# EAGLE board Main_Board (EAGLE 7.6.0), part 1 of 2
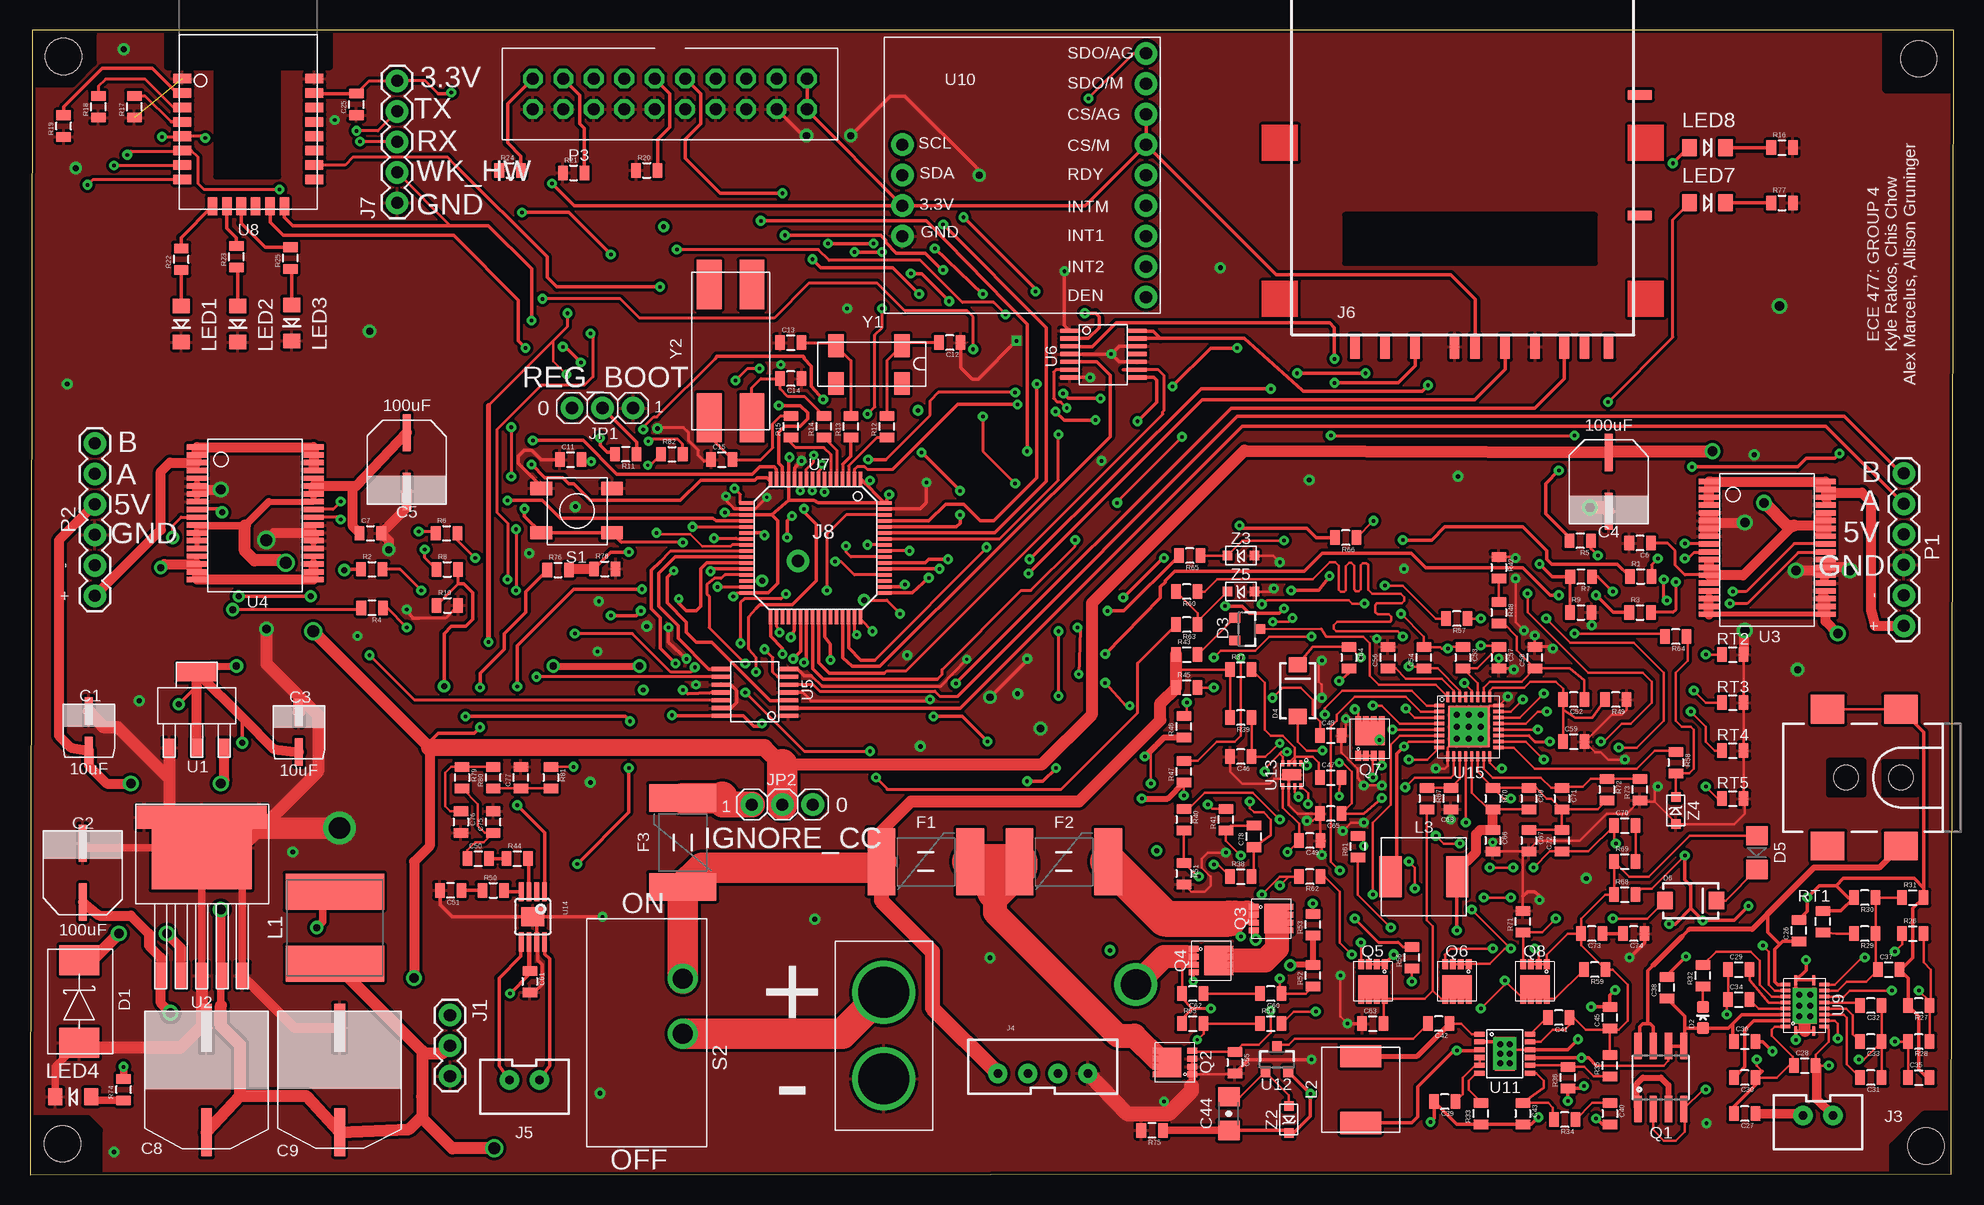
[diagram p9: board, top side]
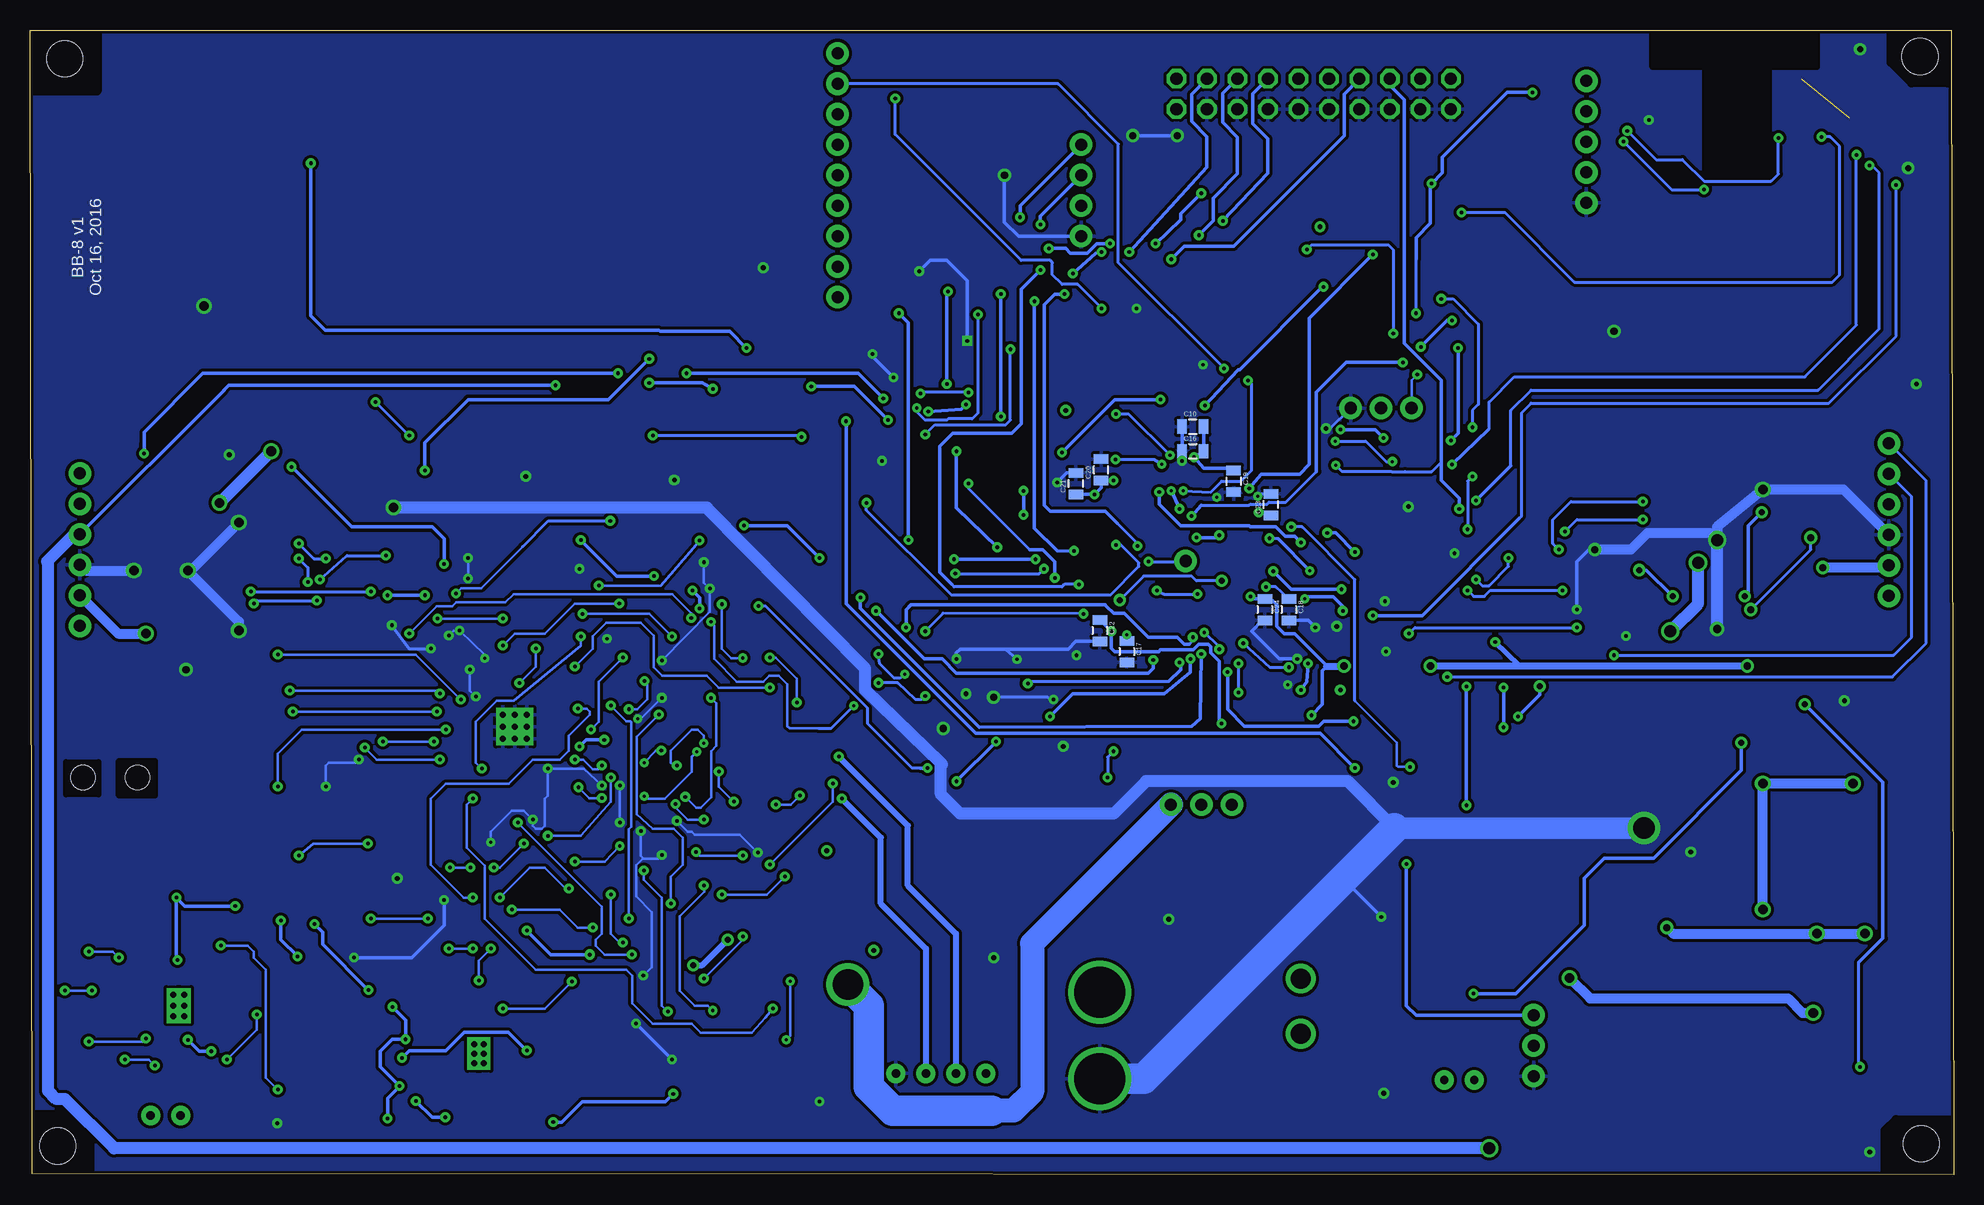
[diagram p10: board, bottom side, seen from below]

Size 160.3 x 95.4 mm. Coordinates in mm from the lower left corner, seen from the top.
Outline: 0,0 160.1,0.1 160.3,95.4 0.2,95.4 0,0
Copper layers (1*16): Top 0.035mm / dielectric 1.5mm / Bottom 0.035mm
Design rules "SparkFun *": minimum track width 5mil, minimum drill 10mil, track to track 5mil, track to pad 5mil, pad to pad 5mil, via to via 5mil, smd to smd 0mil, copper to edge 10mil, drill to drill 10mil, minimum pad ring 12mil, minimum via ring 10mil, stop-mask expansion 4mil, vias tented up to drill 20mil, thermal gap 10mil
Holes 3 mm at 2.7,2.6 158,2.4 157.4,93 2.8,93.2
tRestrict: area 0.5,91 to 5.2,95.1; area 0.1,0.1 to 5.7,4.6; area 154.7,90.5 to 160.2,95.4; area 155.3,0.1 to 160.1,5; area 149.9,31.7 to 152.8,34.5; area 154.5,31.7 to 157.2,34.4; area 11.4,92.3 to 25,95.3; area 15.5,83.2 to 20.7,92.4; area 109.6,76 to 130.4,80
bRestrict: area 0.5,91 to 5.2,95.1; area 0.1,0.1 to 5.7,4.6; area 154.7,90.3 to 160.2,95.4; area 155.3,0.1 to 160.1,5; area 149.9,31.6 to 152.9,34.5; area 154.6,31.7 to 157.3,34.4; area 11.4,92.3 to 25.1,95.4; area 15.4,83.2 to 20.7,92.3

## Footprints (pad centres in the part's own frame; a part is rotated, then mirrored left to right if it is on the bottom)
RADIAL_CAN_SMD-B = smd 0.65 x 2.3: P$1 0,-0.25; P$2 0,3.05
RADIAL_CAN_SMD-D8 = smd 0.65 x 3.1: P$1 0,-0.25; P$2 0,4.65
0805 = smd 0.8 x 1.2: 1 -0.9,0; 2 0.9,0
RADIAL_CAN_SMD-G = smd 0.9 x 4: P$1 0,-0.25; P$2 0,8.46
1206-CAP = smd 1.6 x 1.8: 1 -1.4,0; 2 1.4,0
DO-214AB2 = smd 2.5 x 3.3: A 0,0; C 6.9,0
LED-0603 = smd 1 x 1: A 0,-0.877; C 0,0.877
SOT23-3 = smd 0.8 x 0.9: 1 -0.95,-1; 2 0.95,-1; 3 0,1.1
SMA-DIODE = smd 1.27 x 1.47: A -2.15,0; C 2.15,0
1206-DIODE = smd 1.6 x 1.8: A -1.4,0; D 1.4,0
PTC-2920 = smd 2.3 x 5.6: 1 -3.7,0; 2 3.7,0
1X03 = drill 1.016 pad 1.88: 1 0,0; 2 2.54,0; 3 5.08,0
POWER_JACK_SMD = smd 2.8 x 2.4: GND 0,-5.7; P$4 6.1,-5.7; VIN0 0,5.7; VIN1 6.1,5.7 | hole 2.032: 0,0; 4.572,0
JST-2-PTH-VERT = drill 0.7 pad 1.6: 1 -1.25,-0.55; 2 1.25,-0.55
JST-4-PTH-VERT = drill 0.7 pad 1.6: 1 -3.75,-0.55; 2 -1.25,-0.55; 3 1.25,-0.55; 4 3.75,-0.55
SD-5738 = smd 0.8 x 2: P$1 -6.88,-1; P$2 -4.38,-1; P$3 -1.08,-1; P$4 0.62,-1; P$5 3.12,-1; P$6 5.62,-1; P$7 8.05,-1; P$8 9.75,-1; P$9 -9.38,-1; P$CARDDETECT 11.75,-1 | smd 2 x 0.8: P$COM 14.35,9.95; P$WRITEPROTECT 14.35,20
1X05 = drill 1.016 pad 1.88: 1 0,0; 2 2.54,0; 3 5.08,0; 4 7.62,0; 5 10.16,0
1X01_NO_SILK = drill 1.016 pad 1.88: 1 0,0
SRN8040 = smd 3 x 8.2: P$1 -3,0; P$2 3,0
SPM6530 = smd 1.85 x 3.4: P$1 -2.775,0; P$2 2.775,0
LED-1206 = smd 1.2 x 1.4: A -1.5,0; C 1.5,0
1X06 = drill 1.016 pad 1.88: A 3.81,0; B 6.35,0; GND -1.27,0; MOTOR+ -6.35,0; MOTOR- -3.81,0; VCC 1.27,0
IDC20 = drill 1.02 octagon: P$1 22.86,2.54; P$2 22.86,0; P$3 20.32,2.54; P$4 20.32,0; P$5 17.78,2.54; P$6 17.78,0; P$7 15.24,2.54; P$8 15.24,0; P$9 12.7,2.54; P$10 12.7,0; P$11 10.16,2.54; P$12 10.16,0; P$13 7.62,2.54; P$14 7.62,0; P$15 5.08,2.54; P$16 5.08,0; P$17 2.54,2.54; P$18 2.54,0; P$19 0,2.54; P$20 0,0
SO08 = smd 0.61 x 2.21: 1 -1.905,-2.616; 2 -0.635,-2.616; 3 0.635,-2.616; 4 1.905,-2.616; 5 1.905,2.616; 6 0.635,2.616; 7 -0.635,2.616; 8 -1.905,2.616
SON-8 = smd 0.5 x 0.83: P$1 -0.975,-1.435; P$2 -0.325,-1.435; P$3 0.325,-1.435; P$4 0.975,-1.435; P$5 0.975,1.435; P$6 0.325,1.435; P$7 -0.325,1.435; P$8 -0.975,1.435 | smd 2.45 x 1.9: P$9 0,0.4
5.2X5.2 = smd 1.8 x 1.1: P$1 0,0; P$2 5.9,0; P$3 0,3.7; P$4 5.9,3.7
SWITCH = drill 1.655: P$3 0,4.6; P$4 0,0
SOT-223 = smd 1 x 1.5: P$1 -2.3,0; P$2 0,0; P$3 2.3,0 | smd 3.3 x 1.5: P$4 0,6.3
T0-263-6 = smd 2.16 x 1.07: P$1 0,0; P$2 0,1.7; P$3 0,3.4; P$4 0,5.1; P$5 0,6.8 | smd 6.99 x 8.33: P$6 -10.675,3.4 | smd 1.93 x 1.295: P$7 -13.208,8.191; P$8 -13.208,-1.397
36-BSSOP = smd 1.67 x 0.45: P$1 0,11.05; P$2 0,10.4; P$3 0,9.75; P$4 0,9.1; P$5 0,8.45; P$6 0,7.8; P$7 0,7.15; P$8 0,6.5; P$9 0,5.85; P$10 0,5.2; P$11 0,4.55; P$12 0,3.9; P$13 0,3.25; P$14 0,2.6; P$15 0,1.95; P$16 0,1.3; P$17 0,0.65; P$18 0,0; P$19 9.73,0; P$20 9.73,0.65; P$21 9.73,1.3; P$22 9.73,1.95; P$23 9.73,2.6; P$24 9.73,3.25; P$25 9.73,3.9; P$26 9.73,4.55; P$27 9.73,5.2; P$28 9.73,5.85; P$29 9.73,6.5; P$30 9.73,7.15; P$31 9.73,7.8; P$32 9.73,8.45; P$33 9.73,9.1; P$34 9.73,9.75; P$35 9.73,10.4; P$36 9.73,11.05
14-TSSOP = smd 0.35 x 1.6: P$1 0,0; P$2 0.65,0; P$3 1.3,0; P$4 1.95,0; P$5 2.6,0; P$6 3.25,0; P$7 3.9,0; P$8 3.9,5.6; P$9 3.25,5.6; P$10 2.6,5.6; P$11 1.95,5.6; P$12 1.3,5.6; P$13 0.65,5.6; P$14 0,5.6
LQFP64 = smd 0.3 x 1.2: P$1 -3.82,-6.4; P$2 -3.32,-6.4; P$3 -2.82,-6.4; P$4 -2.32,-6.4; P$5 -1.82,-6.4; P$6 -1.32,-6.4; P$7 -0.82,-6.4; P$8 -0.32,-6.4; P$9 0.18,-6.4; P$10 0.68,-6.4; P$11 1.18,-6.4; P$12 1.68,-6.4; P$13 2.18,-6.4; P$14 2.68,-6.4; P$15 3.18,-6.4; P$16 3.68,-6.4; P$33 3.68,5.1; P$34 3.18,5.1; P$35 2.68,5.1; P$36 2.18,5.1; P$37 1.68,5.1; P$38 1.18,5.1; P$39 0.68,5.1; P$40 0.18,5.1; P$41 -0.32,5.1; P$42 -0.82,5.1; P$43 -1.32,5.1; P$44 -1.82,5.1; P$45 -2.32,5.1; P$46 -2.82,5.1; P$47 -3.32,5.1; P$48 -3.82,5.1 | smd 1.2 x 0.3: P$17 5.68,-4.4; P$18 5.68,-3.9; P$19 5.68,-3.4; P$20 5.68,-2.9; P$21 5.68,-2.4; P$22 5.68,-1.9; P$23 5.68,-1.4; P$24 5.68,-0.9; P$25 5.68,-0.4; P$26 5.68,0.1; P$27 5.68,0.6; P$28 5.68,1.1; P$29 5.68,1.6; P$30 5.68,2.1; P$31 5.68,2.6; P$32 5.68,3.1; P$49 -5.82,3.1; P$50 -5.82,2.6; P$51 -5.82,2.1; P$52 -5.82,1.6; P$53 -5.82,1.1; P$54 -5.82,0.6; P$55 -5.82,0.1; P$56 -5.82,-0.4; P$57 -5.82,-0.9; P$58 -5.82,-1.4; P$59 -5.82,-1.9; P$60 -5.82,-2.4; P$61 -5.82,-2.9; P$62 -5.82,-3.4; P$63 -5.82,-3.9; P$64 -5.82,-4.4
RN4020 = smd 1.5 x 0.8: P$1 -5.5,1.15; P$2 -5.5,-0.05; P$3 -5.5,-1.25; P$4 -5.5,-2.45; P$5 -5.5,-3.65; P$6 -5.5,-4.85; P$7 -5.5,-6.05; P$8 -5.5,-7.25; P$17 5.5,-7.25; P$18 5.5,-6.05; P$19 5.5,-4.85; P$20 5.5,-3.65; P$21 5.5,-2.45; P$22 5.5,-1.25; P$23 5.5,-0.05; P$24 5.5,1.15 | smd 0.8 x 1.5: P$10 -3,-9.5; P$11 -1.8,-9.5; P$12 -0.6,-9.5; P$13 0.6,-9.5; P$14 1.8,-9.5; P$15 3,-9.5
20-VQFN = smd 0.825 x 0.28: P$1 -2.112,0.75; P$10 2.112,0.75; P$11 2.112,-0.75; P$20 -2.112,-0.75 | smd 0.28 x 0.825: P$2 -1.75,1.613; P$3 -1.25,1.613; P$4 -0.75,1.613; P$5 -0.25,1.613; P$6 0.25,1.613; P$7 0.75,1.613; P$8 1.25,1.613; P$9 1.75,1.613; P$12 1.75,-1.613; P$13 1.25,-1.613; P$14 0.75,-1.613; P$15 0.25,-1.613; P$16 -0.25,-1.613; P$17 -0.75,-1.613; P$18 -1.25,-1.613; P$19 -1.75,-1.613 | smd 3 x 2: P$21 0,0 | drill 0.5 pad 0.9 square: P$22 0,0.45; P$23 0.9,0.45; P$24 0.9,-0.45; P$25 0,-0.45; P$26 -0.9,-0.45; P$27 -0.9,0.45
IMU_BREAKOUT = drill 1.016 pad 1.88: 3.3V -10.16,-2.54; CS_AG 10.14,5.08; CS_M 10.14,2.54; DEN 10.14,-10.16; GND -10.16,-5.08; INT1 10.14,-5.08; INT2 10.14,-7.62; INTM 10.14,-2.54; RDY 10.14,0; SCL -10.16,2.54; SDA -10.16,0; SDO_AG 10.14,10.16; SDO_M 10.14,7.62
MSOP-12_GND = smd 0.889 x 0.42: 1 -2.1,1.625; 2 -2.1,0.975; 3 -2.1,0.325; 4 -2.1,-0.325; 5 -2.1,-0.975; 6 -2.1,-1.625; 7 2.1,-1.625; 8 2.1,-0.975; 9 2.1,-0.325; 10 2.1,0.325; 11 2.1,0.975; 12 2.1,1.625 | smd 1.651 x 2.845: 13 0,0 | drill 0.5 pad 0.8 square: P$1 -0.4,0; P$2 0.4,0; P$3 -0.4,0.8; P$4 0.4,0.8; P$5 0.4,-0.8; P$6 -0.4,-0.8
WSON-8 = smd 0.5 x 0.25: P$1 -0.95,0.75; P$2 -0.95,0.25; P$3 -0.95,-0.25; P$4 -0.95,-0.75; P$5 0.95,-0.75; P$6 0.95,-0.25; P$7 0.95,0.25; P$8 0.95,0.75 | smd 0.9 x 1.6: P$GND 0,0
POWER-SOP8 = smd 0.4 x 1.6: 1 -0.975,-2.1; 2 -0.325,-2.1; 3 0.325,-2.1; 4 0.975,-2.1; 5 0.975,2.1; 6 0.325,2.1; 7 -0.325,2.1; 8 -0.975,2.1 | smd 1.89 x 1.57: 9 0,0
S-PVQFN-N32 = smd 0.28 x 0.85: P$1 -1.75,2.475; P$2 -1.25,2.475; P$3 -0.75,2.475; P$4 -0.25,2.475; P$5 0.25,2.475; P$6 0.75,2.475; P$7 1.25,2.475; P$8 1.75,2.475; P$17 1.75,-2.475; P$18 1.25,-2.475; P$19 0.75,-2.475; P$20 0.25,-2.475; P$21 -0.25,-2.475; P$22 -0.75,-2.475; P$23 -1.25,-2.475; P$24 -1.75,-2.475 | smd 0.85 x 0.28: P$9 2.475,1.75; P$10 2.475,1.25; P$11 2.475,0.75; P$12 2.475,0.25; P$13 2.475,-0.25; P$14 2.475,-0.75; P$15 2.475,-1.25; P$16 2.475,-1.75; P$25 -2.475,-1.75; P$26 -2.475,-1.25; P$27 -2.475,-0.75; P$28 -2.475,-0.25; P$29 -2.475,0.25; P$30 -2.475,0.75; P$31 -2.475,1.25; P$32 -2.475,1.75 | drill 0.5 pad 1 square: P$33 0,0; P$34 1,0; P$35 0,1; P$36 -1,0; P$37 1,1; P$38 -1,1; P$39 -1,-1; P$40 0,-1; P$41 1,-1 | smd 3.45 x 3.45: P$GND 0,0
XT60 = drill 4.25 pad 4.675: P$1 0,3.6; P$2 0,-3.6
4-SMD,J-LEAD = smd 1.3 x 1.9: P$1 0,0; P$2 5.5,0; P$3 5.5,3.15; P$4 0,3.15
4-SMD,J-LEAD-2 = smd 4.1 x 2.05: P$1 0,0; P$2 11.1,0; P$3 11.1,3.55; P$4 0,3.55
SOD-323F = smd 0.8 x 0.8: 1 -1.125,0; 2 1.125,0

## Placement (x,y rotation side)
C1  10uF  [RADIAL_CAN_SMD-B]  4.9,35.6 0 top
C2  100uF  [RADIAL_CAN_SMD-D8]  4.4,22.98 0 top
C3  10uF  [RADIAL_CAN_SMD-B]  22.4,35.48 0 top
C4  100uF  [RADIAL_CAN_SMD-D8]  131.55,59.95 180 top
C5  100uF  [RADIAL_CAN_SMD-D8]  31.4,61.6 180 top
C6  470nF  [0805]  134.17,52.64 180 top
C7  470nF  [0805]  28.37,53.46 0 top
C8  470uF  [RADIAL_CAN_SMD-G]  14.7,3.78 0 top
C9  470uF  [RADIAL_CAN_SMD-G]  25.8,3.8 0 top
C10  1uF  [0805]  63.4,62.35 0 bottom
C11  .1uF  [0805]  45.05,59.6 0 top
C12  6.8pF  [0805]  76.65,69.35 180 top
C13  6.8pF  [0805]  63.4,69.35 0 top
C14  20pF  [0805]  63.4,66.35 180 top
C15  20pF  [0805]  57.65,59.6 0 top
C16  100nF  [0805]  63.4,60.3 0 bottom
C17  2.2uF  [0805]  68.9,43.6 270 bottom
C18  2.2uF  [0805]  55.4,47.1 270 bottom
C19  10uF  [0805]  60,57.8 270 bottom
C20  100nF  [0805]  71.05,58.75 90 bottom
C21  100nF  [0805]  73.15,57.6 90 bottom
C22  100nF  [0805]  71.15,45.35 270 bottom
C23  100nF  [0805]  56.9,55.85 90 bottom
C24  100nF  [0805]  57.4,47.1 270 bottom
C25  4.7uF  [0805]  27.2,89.2 90 top
C26  0.1uF  [0805]  147.4,20.35 90 top
C27  270nF  [0805]  142.9,5.1 180 top
C28  2.7nF  [0805]  147.9,9.1 0 top
C29  22nF  [0805]  142.4,17.1 0 top
C30  10nF  [0805]  142.9,8.1 180 top
C31  10nF  [0805]  153.4,8.1 180 top
C32  22nF  [0805]  153.4,14.1 180 top
C33  0.47uF  [0805]  153.4,11.1 180 top
C34  0.47uF  [0805]  142.4,14.6 0 top
C35  0.1uF  [0805]  157.4,8.1 0 top
C36  0.1uF  [0805]  142.9,11.1 0 top
C37  0.1uF  [0805]  154.9,17.1 0 top
C38  4.7uF  [0805]  136.4,15.6 90 top
C39  4.7uF  [0805]  117.9,6.1 180 top
C40  150pF  [0805]  131.65,5.1 270 top
C41  100nF  [0805]  127.4,13.1 180 top
C42  470nF  [0805]  117.4,12.6 180 top
C43  10pF  [0805]  124.4,5.1 270 top
C44  47uF  [1206-CAP]  99.9,5.1 90 top
C45  22uF  [0805]  131.65,13.1 90 top
C46  0.1uF  [0805]  100.9,34.85 180 top
C47  0.1uF  [0805]  108.4,33.1 0 top
C48  0.1uF  [0805]  108.4,36.6 0 top
C49  0.1uF  [0805]  106.65,27.85 180 top
C50  0.1uF  [0805]  37.35,26.35 0 top
C51  0.1uF  [0805]  35.05,23.7 180 top
C52  0.1uF  [0805]  128.65,39.6 180 top
C53  0.1uF  [0805]  119.4,43.1 270 top
C54  0.1uF  [0805]  116.15,43.1 90 top
C55  0.1uF  [0805]  100.4,9.35 270 top
C56  2.2uF  [0805]  113.15,43.1 90 top
C57  0.1uF  [0805]  122.4,43.1 270 top
C58  0.1uF  [0805]  125.4,43.1 90 top
C59  0.1uF  [0805]  128.65,36.1 0 top
C60  0.1uF  [0805]  103.4,15.1 180 top
C61  1uF  [0805]  41.65,16.1 270 top
C62  0.1uF  [0805]  96.9,15.1 180 top
C63  10uF  [0805]  111.9,12.6 0 top
C64  0.1uF  [0805]  109.9,43.1 270 top
C65  1.5uF  [0805]  108.4,30.1 180 top
C66  0.1uF  [0805]  121.9,27.85 270 top
C67  0.1uF  [0805]  124.9,27.85 270 top
C68  1uF  [0805]  118.4,31.35 90 top
C69  0.1uF  [0805]  124.9,31.35 270 top
C70  2.2uF  [0805]  132.9,29.1 0 top
C71  22pF  [0805]  127.65,31.35 270 top
C72  22uF  [0805]  127.65,27.85 90 top
C73  0.1uF  [0805]  130.15,20.1 180 top
C74  0.1uF  [0805]  133.65,20.1 180 top
C75  0.1uF  [0805]  38.6,29.4 90 top
C76  0.1uF  [0805]  35.9,29.4 270 top
C77  0.1uF  [0805]  40.9,33.1 90 top
C78  0.1uF  [0805]  101.99,28.19 90 top
D1  SCHOTTKY_DIODE  [DO-214AB2]  4.1,11 90 top
D2  GREEN  [LED-0603]  139.4,13.1 0 top
D3  BAS16-SOT3  [SOT23-3]  101.4,45.48 270 top
D4  MBRA140  [SMA-DIODE]  105.65,40.35 90 top
D5  D-1206  [1206-DIODE]  143.9,26.85 270 top
D6  MBRA140  [SMA-DIODE]  138.4,22.85 0 top
F1  4A  [PTC-2920]  74.65,26.1 0 top
F2  4A  [PTC-2920]  86.15,26.1 0 top
F3  4A  [PTC-2920]  54.4,27.7 90 top
FRAME1  FRAME-LEDGER  [CREATIVE_COMMONS]  0,-20 0 top  (outside the outline)
FRAME2  FRAME-LEDGER  [CREATIVE_COMMONS]  0,-20 0 top  (outside the outline)
FRAME3  FRAME-LEDGER  [CREATIVE_COMMONS]  0,-20 0 top  (outside the outline)
FRAME4  FRAME-LEDGER  [CREATIVE_COMMONS]  0,-20 0 top  (outside the outline)
FRAME5  FRAME-LEDGER  [CREATIVE_COMMONS]  0,-20 0 top  (outside the outline)
FRAME6  FRAME-LEDGER  [CREATIVE_COMMONS]  0,-20 0 top  (outside the outline)
FRAME7  FRAME-LEDGER  [CREATIVE_COMMONS]  0,-20 0 top  (outside the outline)
FRAME8  FRAME-LEDGER  [CREATIVE_COMMONS]  0,-20 0 top  (outside the outline)
J1  SERVO  [1X03]  35,13.3 270 top
J2  5.5x2.1mm Barrel  [POWER_JACK_SMD]  155.9,33.1 180 top
J3  [JST-2-PTH-VERT]  149,4.4 180 top
J4  BATTERY  [JST-4-PTH-VERT]  84.4,9 0 top
J5  SPEAKER  [JST-2-PTH-VERT]  41.2,7.35 180 top
J6  SDIO-SDCARD  [SD-5738]  119.8,70 0 top
J7  [1X05]  30.6,81 90 top
J8  [1X01_NO_SILK]  64,51.15 0 top
JP1  REG_BOOT  [1X03]  50.25,63.9 180 top
JP2  IGNORE_CC  [1X03]  60.15,30.85 0 top
L1  100uH  [SRN8040]  25.4,20.6 90 top
L2  3.3uH  [SPM6530]  110.9,7.1 90 top
L3  2.2uH  [SPM6530]  116.15,24.85 0 top
LED1  [LED-1206]  12.6,70.9 270 top
LED2  [LED-1206]  17.3,70.9 270 top
LED3  [LED-1206]  21.8,71 270 top
LED4  [LED-1206]  3.6,6.5 180 top
LED7  [LED-1206]  139.8,81 0 top
LED8  [LED-1206]  139.8,85.6 0 top
P1  MOTOR_HEADER  [1X06]  156.15,52.1 90 top
P2  MOTOR_HEADER  [1X06]  5.4,54.6 90 top
P3  JTAG  [IDC20]  41.9,88.8 0 top
Q1  SI9933CDY-PFET  [SO08]  135.9,8.1 0 top
Q2  CSD17308Q3  [SON-8]  95.4,9.35 90 top
Q3  CSD17308Q3  [SON-8]  103.4,21.35 270 top
Q4  CSD17308Q3  [SON-8]  98.4,17.85 270 top
Q5  CSD17308Q3  [SON-8]  111.9,16.1 180 top
Q6  CSD17308Q3  [SON-8]  118.9,16.1 180 top
Q7  CSD17308Q3  [SON-8]  111.65,36.35 0 top
Q8  CSD17308Q3  [SON-8]  125.4,16.1 180 top
R1  4.7K  [0805]  134.23,49.86 0 top
R2  4.7K  [0805]  28.49,50.46 0 top
R3  4.7K  [0805]  134.17,46.86 0 top
R4  4.7K  [0805]  28.5,47.24 180 top
R5  4.7K  [0805]  129.19,52.84 180 top
R6  4.7K  [0805]  34.71,53.46 0 top
R7  .756K  [0805]  129.25,49.84 180 top
R8  .768K  [0805]  34.77,50.45 0 top
R9  .244K  [0805]  129.24,46.86 0 top
R10  .232K  [0805]  34.78,47.45 0 top
R11  10K  [0805]  49.65,60.05 180 top
R12  0  [0805]  71.4,62.35 90 top
R13  0  [0805]  68.4,62.35 90 top
R14  0  [0805]  66.15,62.35 90 top
R15  220  [0805]  63.4,62.35 90 top
R16  100  [0805]  146,85.6 0 top
R17  10K  [0805]  8.7,89 90 top
R18  10K  [0805]  5.7,89 90 top
R19  10K  [0805]  2.8,87.4 90 top
R20  10K  [0805]  51.4,83.7 0 top
R21  10K  [0805]  45.3,83.5 0 top
R22  1K  [0805]  12.6,76.3 90 top
R23  1K  [0805]  17.2,76.5 90 top
R24  10K  [0805]  40,83.7 0 top
R25  1K  [0805]  21.7,76.4 90 top
R26  66  [0805]  156.9,20.1 0 top
R27  196  [0805]  157.4,14.1 180 top
R28  20k  [0805]  157.4,11.1 180 top
R29  4.7k  [0805]  152.9,20.1 180 top
R30  100k  [0805]  152.9,23.1 180 top
R31  100k  [0805]  156.9,23.1 0 top
R32  1500  [0805]  139.4,16.6 90 top
R33  57.6k  [0805]  120.9,5.1 90 top
R34  365k  [0805]  127.9,4.6 180 top
R35  1.3M  [0805]  131.65,9.1 90 top
R36  113k  [0805]  128.15,8.1 90 top
R37  1k  [0805]  100.9,42.1 0 top
R38  1k  [0805]  100.9,24.85 0 top
R39  100  [0805]  100.9,38.1 180 top
R40  5.1k  [0805]  96.15,29.6 270 top
R41  1k  [0805]  99.65,29.6 90 top
R42  5m  [0805]  122.4,50.6 270 top
R43  10  [0805]  96.4,43.35 0 top
R44  150k  [0805]  40.6,26.35 0 top
R45  100  [0805]  96.4,40.6 0 top
R46  100  [0805]  96.15,37.35 90 top
R47  100  [0805]  96.15,33.6 90 top
R48  100  [0805]  122.4,46.85 270 top
R49  100  [0805]  132.15,39.6 180 top
R50  150k  [0805]  38.6,23.7 0 top
R51  5.1k  [0805]  96.15,25.1 270 top
R52  10M  [0805]  106.9,16.6 90 top
R53  5.1k  [0805]  106.9,20.85 90 top
R54  5.1k  [0805]  103.4,12.6 0 top
R55  10M  [0805]  96.9,12.6 0 top
R56  5.1k  [0805]  115.15,18.1 90 top
R57  100  [0805]  118.9,46.35 180 top
R58  100  [0805]  137.15,34.35 270 top
R59  10M  [0805]  130.4,17.1 180 top
R60  100  [0805]  96.4,48.6 180 top
R61  10k  [0805]  110.65,27.35 90 top
R62  5.1k  [0805]  106.65,24.85 180 top
R63  100  [0805]  96.4,45.85 180 top
R64  100  [0805]  137.15,44.85 180 top
R65  1k  [0805]  96.65,51.6 180 top
R66  100  [0805]  109.65,53.1 180 top
R67  1  [0805]  116.4,31.35 270 top
R68  100k  [0805]  132.9,23.35 0 top
R69  2  [0805]  132.9,26.1 0 top
R70  10m  [0805]  121.9,31.35 270 top
R71  10k  [0805]  124.4,21.1 90 top
R72  332k  [0805]  131.4,32.1 270 top
R73  35.63k  [0805]  134.15,32.1 90 top
R74  1K  [0805]  7.8,7.1 90 top
R75  0  [0805]  93.5,3.7 180 top
R76  9.7K  [0805]  44,50.4 0 top
R77  100  [0805]  146,81 0 top
R78  3.3K  [0805]  47.9,50.5 0 top
R79  100  [0805]  36,33.1 270 top
R80  100  [0805]  38.6,33.1 90 top
R81  100  [0805]  43.4,33.1 270 top
R82  100  [0805]  53.49,60.05 0 top
RT1  10K-NTC  [0805]  149.4,21.1 90 top
RT2  10k-NTC  [0805]  141.9,43.35 0 top
RT3  10k  [0805]  141.9,39.35 0 top
RT4  10k  [0805]  141.9,35.35 0 top
RT5  10k  [0805]  141.9,31.35 0 top
S1  RESET_BUTTON  [5.2X5.2]  42.6,53.5 0 top
S2  SWITCH  [SWITCH]  54.4,16.35 180 top
U1  LMS8117  [SOT-223]  13.9,35.6 0 top
U2  5V_BUCK_REG  [T0-263-6]  10.9,16.6 270 top
U3  BTM7752G  [36-BSSOP]  139.9,46.71 0 top
U4  BTM7752G  [36-BSSOP]  13.9,49.6 0 top
U5  SN74LV4T125  [14-TSSOP]  63.2,38.25 90 top
U6  SN74LV4T125  [14-TSSOP]  86.65,70.35 270 top
U7  STM32F405RGT6  [LQFP64]  65.4,51.6 180 top
U8  RN4020RN4020  [RN4020]  18.2,90.2 0 top
U9  BQ51013B-20VQFN  [20-VQFN]  147.9,14.1 90 top
U10  IMU  [IMU_BREAKOUT]  82.86,83.3 0 top
U11  LTC3122-MSOP  [MSOP-12_GND]  122.9,10.1 0 top
U12  CBAT54S-SOT23-3  [SOT23-3]  103.9,9.6 0 top
U13  BQ2947  [WSON-8]  105.15,33.35 270 top
U14  TPA2005D1DGN  [POWER-SOP8]  41.9,21.5 180 top
U15  BQ40Z60  [S-PVQFN-N32]  119.9,37.35 0 top
U$1  XT60  [XT60]  71.15,11.6 180 top
Y1  32.768KHz  [4-SMD,J-LEAD]  72.65,69.1 180 top
Y2  25MHz  [4-SMD,J-LEAD-2]  60.15,63.1 90 top
Z2  DDZ16ASF-7  [SOD-323F]  104.9,4.6 270 top
Z3  MM3Z75VC  [SOD-323F]  100.9,51.6 180 top
Z4  MM3Z75VC  [SOD-323F]  137.15,30.35 90 top
Z5  MM3Z75VC  [SOD-323F]  100.9,48.6 180 top

## Tracks (layer width: path | path; a pad name or v marks a point on that pad's centre or on a via)
3.3V  (via drill 0.3, 0.5, 0.6)
  Top 0.2: 44.8,70.7 43.6,69.5 43.6,67.8 v44.7,66.7
  Top 0.254: U7.P$32 59.7,48.48 58.88,48.48 | 38.2,64.1 44.8,70.7 v44.8,71.8 | 34,90.1 32.94,91.16 J7.5 28.26,91.16 C25.2 | U7.P$48 69.22,46.28 v70.2,45.3
  Top 0.3: v35.1,90.2 35,90.1 34,90.1 | U7.P$19 58.1,55 v57.9,55.2 | 58.88,48.48 v58.6,48.2 | 60.8,37.4 v61,37.6
  Top 0.305: U7.P$64 71.32,56 v71.6,56.7 | v70,57.85 69.75,57.6 69.6,57.6 69.22,57.98 U7.P$1 71.2,56.02 71.2,56 65.7,56 65.32,56.22 63.22,56.22 | v63.3,59.8 63.22,59.58 U7.P$13 63.22,56.22 | v53.5,38.3 53.55,38.25 U5.P$14 59.45,38.25 60.3,37.4 60.8,37.4 | U7.P$19 61.8,55 | 61.8,55 62.3,54.5 62.3,49.3 61.5,48.5 U7.P$32 | 61.8,55 63.22,56.22 | U10.3.3V 45.34,80.76 v43.5,82.6 | U10.CS_AG U10.CS_M | C61.1 41.65,19.32 U14.6 41.58,16.68 v40,15.1 | v17.7,36 17.7,38 17.75,38.05 | v12.4,39.2 13.9,40.7 | U8.P$23 23.75,90.1 C25.2 | U10.CS_M 87.92,80.76 U10.3.3V | P3.P$2 P3.P$1 64.76,88.7 U10.3.3V | 34,90.1 34.1,90.1 | U10.CS_M 103.84,75 118.4,75 120.42,72.98 J6.P$4
  Top 0.406: U1.P$4 14.8,41.9 15.1,42.2 15.1,42.3 15.2,42.4 | 38.2,64.1 v38.2,44.4
  Top 0.6: 15.2,42.4 v17.2,42.4 | v43.6,42.4 v50.8,42.4
  Top 0.61: R74.2 v7.8,9
  Top 0.813: U1.P$2 13.9,40.7 U1.P$4 17.75,38.05 20.32,35.48 C3.P$1
  Bottom 0.2: v44.7,66.7 45.17,66.23 JP1.3
  Bottom 0.254: 58.05,48 C24.1 | v44.8,71.8 44.8,76.3 | v7.8,9 7.9,9.1 7.9,17.7
  Bottom 0.3: v35.1,90.2 37.2,90.2 42.6,84.8 42.6,83.5 v43.5,82.6 43.6,82.5 43.6,79.3 44.8,78.1 44.8,76.3 | v57.9,55.2 57.05,55.1 C23.1 | v58.6,48.2 58.4,48 58.05,48 | v61,37.6 61.2,37.8 61.2,42.8 61.9,43.5 61.9,44 62.1,44.2 62.9,44.2 63.35,43.75 66.1,43.75 66.25,43.6 69.9,43.6 70.2,43.9
  Bottom 0.305: C23.1 56.95,55 | C22.1 v70.2,45.3 70.2,43.9 | C21.1 v71.6,56.7 71.05,57.25 C20.1 v70,57.85 | C10.2 C16.2 v63.3,59.8 62.5,58.9 60.2,58.9 C19.1 | v53.5,38.3 52.6,39.2 52.6,42 52.25,42.35 52.2,42.4 54.9,45.1 55.8,45.1 56.4,45.7 56.4,47.5 56.9,48 C24.1 | v40,15.1 36.5,15.1 30.8,20.8 30.8,24.7 29.1,26.4 25,26.4 17.7,33.7 v17.7,36 | 7.9,17.7 5.9,19.7 5.9,32.7 v12.4,39.2
  Bottom 0.406: v38.2,44.4 37.3,43.5 36.1,42.4
  Bottom 0.6: v17.2,42.4 36.1,42.4 v43.6,42.4 | v50.8,42.4 50.95,42.35 52.25,42.35
5V  (via drill 0.3, 0.8, 1)
  Top 0.3: 106,65.4 101.2,69.7 94.2,69.7 | 106.1,65.3 116,65.3 v116.5,65.8
  Top 0.305: U2.P$4 15.9,16.6 | U6.P$13 94.2,69.7 93.6,70.3 92.3,70.3 U6.P$14 | 106,65.4 106.1,65.3
  Top 0.61: 15.9,16.6 15.9,14.1 15.9,13.6
  Top 0.813: U2.P$4 15.9,16.7 v15.9,22.1 | v15.9,32.6 16.2,32.9 U1.P$3 | v8.4,32.6 6.4,32.6 4.9,34.1 C1.P$1 3.4,35.6 2.4,36.6 2.4,52.87 P2.VCC
  Top 1: 32.66,6.54 32.7,6.5 | 32.7,6.5 32.7,4.9 | 32.7,4.9 32.7,4.7 35.2,2.2 v38.7,2.2 | C8.P$1 17.5,6.58 | 17.5,6.58 17.5,10.8 15.9,12.4 15.9,14.1 | 17.5,6.58 23.02,6.58 C9.P$1 31.6,3.8 32.7,4.9 | L1.P$1 32.7,10.3 32.7,10.1 | 32.7,10.1 32.7,6.5 | J1.2 34.34,10.1 32.7,10.1
  Bottom 0.3: v116.5,65.8 143.72,65.8 144.71,64.81
  Bottom 0.305: P1.VCC 144.71,64.81 144.12,65.4
  Bottom 0.813: v15.9,22.1 v15.9,32.6 v8.4,32.6
  Bottom 1: P1.VCC 156.63,53.37 158.9,51.1 158.8,51 158.8,7 158.1,6.3 157.4,6.3 153.3,2.2 v38.7,2.2
12V_BAT
  Top 0.2: R39.2 R37.1 96,42.1 95.5,42.6
  Top 1: F1.1 70.9,26.15 70.9,28.6 73.4,31.1 87.4,31.1 94.2,37.9 94.2,39.3 R45.1 95.5,42.6 R43.1
  Top 1.27: F1.1 70.95,22.85 75.2,18.6 75.2,13.9 J4.1
  Top 2.54: F1.1 70.45,25.6 56,25.6 F3.1 S2.P$4
12V_CC  (via drill 0.3, 2.54)
  Top 0.2: R72.2 130.65,30.45 C71.2 | C71.2 C72.2 C67.1 | C71.2 126.75,31.35 126.4,31.35 125.5,32.25 C69.1 R70.1 | R70.1 120.65,33.6 U15.P$19 | Q4.P$3 Q4.P$2 Q4.P$1 96.32,18.18 96,17.86 C62.2 | R70.1 122.8,31.35 v123.4,31.35
  Top 0.254: v98.4,13.85 96.85,13.85 | 96.85,13.85 96,13 R55.1 | 96.85,13.85 96,14.7 C62.2
  Top 1.9: 96.32,18.18 94.48,18.18
  Top 1.93: v92.15,15.85 94.48,18.18
  Bottom 0.2: v123.4,31.35 123.9,30.85 123.9,27.25 122.4,25.75 122.4,21.35 118.15,17.1 110.6,17.1 110.1,16.6 110.1,14.3 108.4,12.6 105.15,12.6 104.4,11.85 100.15,11.85 99.03,13.1 v98.4,13.85
  Bottom 2: JP2.3 76.8,19.28 76.8,6.9 78.35,5.35 80.15,5.35
  Bottom 2.54: 80.15,5.35 88.4,5.35 90.4,7.35 90.4,14.1 v92.15,15.85
!NRST  (via drill 0.25, 0.3)
  Top 0.254: v54.4,52.7 49.3,52.7 49.2,52.8 | v51.49,59.13 51.68,59.13 R82.1
  Top 0.305: 49.2,52.8 S1.P$2 S1.P$1 41.2,54.9 v41.2,55.5 | v66.2,56.9 66.22,57.12 U7.P$7
  Bottom 0.254: 42.7,59.5 42.7,59.4 43.5,58.6 45.7,58.6 46.84,58.6 50.95,58.6 v51.49,59.13
  Bottom 0.3: 58.6,54 56.5,54 56.2,53.7
  Bottom 0.305: v54.4,52.7 54.9,53.2 55.7,53.2 56.2,53.7 | 58.6,54 58.7,54.1 64.4,54.1 66.2,55.9 v66.2,56.9 | P3.P$15 46.98,90.78 45.8,89.6 45.8,69.3 42.7,66.2 42.7,59.5 42.7,57.9 41.2,56.4 v41.2,55.5
AC1  (via drill 0.3)
  Top 0.2: C29.1 C34.1 141.5,14.2 141.4,14.1 v141.4,13.35 | v143.9,9.6 143.9,9.1 144.35,8.65 | U9.P$2 145.4,12.35 145.15,12.1 145.15,11.6 146.9,9.85 146.9,9.2 C28.1 | 146.93,9.47 145.55,8.1 C30.1
  Top 0.3: C27.2 142,5.7 143.8,7.5 C30.1 144.35,8.65 | 146.93,9.47 C28.1
  Bottom 0.2: v141.4,13.35 141.4,12.1 v143.9,9.6
AC2  (via drill 0.3)
  Top 0.2: U9.P$19 149.65,12.35 149.9,12.1 149.9,11.1 148.8,10 C28.2 | C31.1 C33.1 | C32.1 C33.1 | C33.1 152.8,9.6 v152.4,9.6 | v149.9,9.1 148.9,9.1
  Top 0.8: 148.9,9.1 148.9,9 | 148.9,9 C28.2 | 148.9,9 148.9,6.3 J3.1
  Bottom 0.2: v152.4,9.6 150.4,9.6 v149.9,9.1
AUDIO+
  Top 0.305: U14.5 40.9,19.38 40.9,18.2 39.1,16.4 39.1,9.1 J5.2
AUDIO-
  Top 0.305: U14.8 42.9,19.38 42.9,18.4 43.3,18 43.3,9.1 J5.1
AUDIO_PWM  (via drill 0.3)
  Top 0.2: v45.3,34 R81.1
  Top 0.254: v55.2,54 U7.P$21
  Bottom 0.2: 49.9,39.5 46.4,36 46.4,34.1 46.3,34 v45.3,34
  Bottom 0.254: 49.9,39.5 49.9,49.6 54.3,54 v55.2,54
BATT  (via drill 0.3)
  Top 0.2: 54.5,53.4 55,53.4 56,52.4 58.4,52.4 58.5,52.5 | 54.5,53.4 54.4,53.4 | 52.3,53.4 54.5,53.4
  Top 0.254: U7.P$24 58.5,52.5 | v52.2,53.5 52.3,53.4
  Top 0.305: R78.1 48.4,51.9 v49.9,51.9
  Top 0.813: R76.2 45,50.5 R78.1
  Bottom 0.305: v49.9,51.9 51.5,53.5 v52.2,53.5
BLU_CMD  (via drill 0.25, 0.3)
  Top 0.254: v4.8,82.5 5.25,82.95 U8.P$8
  Top 0.305: U7.P$27 56.4,51 55.9,50.5 55.9,47.4 55.52,47.02 54.69,47.02 54.08,47.62 v54.08,48.01 | v50.9,47 50.5,46.6 v48.4,46.6
  Bottom 0.254: 36.2,54.7 36,54.9 36,63.5 35.2,64.3 10.4,64.3 4.8,69.9 v4.8,82.5
  Bottom 0.305: v48.4,46.6 44.3,46.6 36.2,54.7 | v54.08,48.01 53.9,48.18 51.69,48.18 50.9,47.4 v50.9,47
BLU_CTS  (via drill 0.3)
  Top 0.3: 35.3,78.3 40.7,72.9 40.7,69.5 v41.3,68.9
  Top 0.305: U7.P$15 62.2,58.02 62.2,58.8 62,59 60.8,59 60.2,58.4 48.9,58.4 46.1,61.2 v41.9,61.2 | 35.3,78.3 21.1,78.3 20,79.4 U8.P$14
  Bottom 0.3: v41.3,68.9 41.3,61.8
  Bottom 0.305: v41.9,61.2 41.3,61.8
BLU_RTS  (via drill 0.3)
  Top 0.254: 35.45,84.15 34.8,84.8 26.9,84.8 26.25,84.15 U8.P$18
  Top 0.3: 35.45,84.15 43.1,76.5 43.1,74.8 43.9,74 | 63.1,62.4 62.9,62.4 62.4,61.9 62.4,61.7
  Top 0.305: U7.P$14 62.7,58.02 62.7,59 62.4,59.3 62.4,61.7 | 63.1,62.4 64.2,62.4 64.8,63 64.8,63.5 64.2,64.1 v62.4,64.1 | v52.5,74 43.9,74
  Bottom 0.305: v62.4,64.1 59.6,67.1 59.5,67.1 52.6,74 v52.5,74
BLU_RX  (via drill 0.3)
  Top 0.254: J7.3 30.58,86.1 v27.5,86.1 | v20.8,82.1 14.5,82.1 14,82.6 14,84.8 13.45,85.35 U8.P$6 12.65,85.3 8.4,85.3 v8.1,85
  Top 0.305: 61.62,57.9 U7.P$16 61.7,57.98 61.7,57.8 61.4,58.1 60.6,58.1 60.4,57.9 55.9,57.9 54.2,56.2 46.7,56.2 45.3,57.6 44.9,57.6 44.4,58.1 42.9,58.1 v41.8,59.2
  Bottom 0.254: 38.8,62.1 38.7,62.2 38.7,64.4 36.6,66.5 12.4,66.5 8.1,70.8 v8.1,85 | v27.5,86.1 23.5,82.1 v20.8,82.1
  Bottom 0.3: 38.8,62.1 v41.8,59.2
BLU_TX  (via drill 0.3)
  Top 0.254: v11,86.5 12.65,86.5 U8.P$5 14.45,86.55 v14.6,86.4 | 59.2,56 59.2,56.7 v58.7,57.2 | J7.4 28.98,87 v27.2,87
  Top 0.3: v41,80.2 44.9,80.2 v48.4,76.7
  Top 0.305: U7.P$17 59.2,56
  Bottom 0.254: v41,80.2 37.4,80.2 31.6,74.4 10.1,74.4 9.5,75 9.5,85.7 10.3,86.5 v11,86.5 | v27.2,87 24.8,84.6 22.6,84.6 20.8,82.8 15.2,82.8 14.6,83.4 v14.6,86.4
  Bottom 0.305: v58.7,57.2 57.7,58.4 54.5,58.4 53.7,59.2 53.7,71.4 v48.4,76.7
BLU_WAKE_HW  (via drill 0.3)
  Top 0.254: J7.2 35.04,79.1 37.4,79.1
  Top 0.3: 41.8,75.5 v41.8,71.2
  Top 0.305: U7.P$22 61,53.5 v61.2,53.3 | v45.9,67.7 44.6,69 v44.4,69 | U8.P$15 21.2,79.8 21.9,79.1 37.4,79.1 38.2,79.1 41.8,75.5 | v63.1,53.1 63.1,54.5 v63.5,54.9
  Bottom 0.254: 62.7,55.8 58.7,55.8 58.6,55.9 57.2,55.9 57.05,56.05 55.65,56.05 53.1,58.6
  Bottom 0.3: v41.8,71.2 42.2,71.2 v44.4,69
  Bottom 0.305: v61.2,53.3 61.4,53.1 v63.1,53.1 | v63.5,54.9 62.7,55.8 | 53.1,58.6 53.1,65.2 50.6,67.7 v45.9,67.7
BLUE_WAKE_SW  (via drill 0.3)
  Top 0.254: v7,84.1 7.05,84.15 U8.P$7
  Top 0.305: U7.P$20 57.2,54.5 56.9,54.7 44.2,54.7 42.7,56.2 v39.8,56.2
  Bottom 0.254: 36.9,59.1 36.9,63.7 35.2,65.4 11.3,65.4 6.2,70.5 6.2,83.5 6.8,84.1 v7,84.1
  Bottom 0.305: v39.8,56.2 36.9,59.1
BOOT2
  Top 0.2: U9.P$17 151.15,13.35 151.4,13.1 151.4,9.2 C31.2
CHRG_GPIO_SYSPRES  (via drill 0.3)
  Top 0.3: R65.2 91.15,47 v89.8,47 | U7.P$42 66.22,44.82 66.7,44.2 v66.7,42.9
  Bottom 0.3: v89.8,47 85.8,43 84.3,43 83.1,41.8 67.1,41.8 66.7,42.2 v66.7,42.9
CHRG_I2C_SCL  (via drill 0.3)
  Top 0.254: U7.P$29 57.9,50 57.6,49.7 57,49.7 56.4,49.2 56.4,48.4 56.6,48.2 56.6,45.6 v59.6,42.6 | v59.6,40.2 64.5,35.3 v70,35.3 | v70.5,33.1 71.4,32.2 71.4,32.1 85.9,32.1 92.3,38.5 92.3,42.65 R63.2
  Bottom 0.254: v59.6,42.6 v59.6,40.2 | v70,35.3 70.5,34.8 v70.5,33.1
CHRG_I2C_SDA  (via drill 0.25, 0.3, 0.5)
  Top 0.2: R64.2 136,45.1 v128.7,45.1 | v105.2,46.4 104.9,46.1 v103.55,46.1
  Top 0.254: U7.P$30 v61,49.5 | v69.5,47.9 71.4,47.9 v72.5,46.75 | v85.7,45.3 v85.7,39.9 | v89.6,41 91.3,39.1 v91.65,39.1
  Bottom 0.2: v128.7,45.1 126.4,47.4 125.1,47.4 124.8,47.7 120.7,47.7 120,48.4 106.8,48.4 105.2,46.8 v105.2,46.4 | v103.55,46.1 103.3,45.75 103.3,43 101.4,41.1 99.2,41.1 98.7,41.6 97.9,41.6 97.2,40.9 97.2,37.4 97,37.2 94.6,37.2
  Bottom 0.254: v61,49.5 63.1,49.5 63.5,49.9 67.5,49.9 v69.5,47.9 | v72.5,46.75 84.2,46.8 v85.7,45.3 | v85.7,39.9 86,39.6 86.5,39.6 88,41 v89.6,41 | 94.6,37.2 93.55,37.2 v91.65,39.1
CHRG_I2C_SMBA  (via drill 0.3)
  Top 0.3: U7.P$33 61.72,44.86 62.7,43.88 v62.7,43.4 | v91.1,48.1 94.4,51.4 v94.5,51.4 | v100.8,54.1 101,53.9 106.4,53.9 107.2,53.1 R66.2
  Bottom 0.3: v62.7,43.4 62.8,38 63.5,37.4 81.2,37.3 91.1,47.2 v91.1,48.1 | v94.5,51.4 97.2,54.1 v100.8,54.1
GND  (via drill 0.25, 0.3, 0.38, 0.4, 0.5, 0.6, 0.7, 0.8, 1, 1.8)  (1 unrouted)
  Top 0.2: v123.15,39.85 123.12,39.85 U15.P$9 121.65,39.1 U15.P$33 118.15,35.6 U15.P$24 118.15,34.1 117.9,33.85 v117.15,33.85 | v123.65,42.1 123.55,42.2 C57.2 v122.4,43.05 | RT2.2 RT3.2 RT4.2 RT5.2 142.9,31.25 142.9,30.1 142.03,29.23 Z4.1 137.15,29.35 135.4,31.1 | C55.2 100.33,8.38 Q2.P$1 | Q2.P$2 Q2.P$3 | 135.4,31.1 134.25,31.1 R73.1 133.05,30.1 131.4,30.1 129.15,27.85 125.65,27.85 124.9,27.1 C67.2 | R49.1 133.05,38.75 132.65,38.35 131.8,38.35 C59.2 130.43,35.23 130.9,35.23 131.53,34.6 v132.9,34.6 | v118.4,29.6 C68.1 | v109.65,38 109.65,36.6 C48.2 109.28,36.58 109.28,35.23 110.65,33.85 110.65,33.1 v111.15,32.45 v112.65,32.45 | v107.65,39.75 107.65,40.85 107.4,41.1 107.4,42.6 v107.65,42.85 | C65.2 105.65,30.1 104.9,30.85 U13.P$6 104.9,33.1 U13.P$GND 104.8,33 103.7,33 103.3,32.6 101,32.6 100,33.6 C46.2 | C65.2 107.5,27.9 C49.1 | R71.2 124.4,23.2 124.4,26.45 C67.2 | C67.2 C66.2 v121.9,27.72 | C58.2 v125.4,44.95 | C65.2 107.53,30.07 107.53,27.73 107.65,27.6 v107.65,26.65 | v109.4,28.65 110.1,29.35 v111.15,29.35 | v135.65,32.35 135.4,32.1 135.4,31.1 | v106.4,29.5 106.9,29.5 C65.2 | R51.2 96.75,23.6 97.9,23.6 98.4,24.1 98.4,24.85 97.65,25.6 97.65,26.35 98.15,26.85 v99.65,26.85 | Z3.1 103.6,51.6 v104.15,51.05 | v103.65,48.85 103.4,48.6 Z5.1 | v124.5,45.35 123.8,46.05 v123.8,49.7 | v123.8,51.4 123.7,51.5 R42.1 | v109.2,16.6 109.2,13.2 v109.8,12.6
  Top 0.254: R10.2 34.63,46.4 32.4,46.4 | U3.P$5 140.46,54.6 141.9,54.6 141.65,54.35 | R9.2 v130.15,45.8 | v126.9,43.85 126.75,44 C58.2 | U5.P$7 63.2,42.1 | v75,39.6 74.8,39.5 65.1,39.5 64.4,40.2 | v78.05,42.95 75.9,40.7 66,40.7 65.1,41.6 | U5.P$4 62.9,40.2 62.8,40.1 | 59.6,55.5 60.45,55.5 v61.4,56.45 | 58.7,55.5 58.1,56.1 v58,56.55 | C15.1 56.75,59.49 56.72,59.46 56.19,59.46 55.7,59.94 55.7,60.38 54.89,61.19 54.89,61.82 54.46,62.26 52.38,62.26 v52.3,62.18
  Top 0.3: U14.9 42.23,21.18 U14.7 | C12.1 77.55,67.25 78.5,66.3 79,66.3 v82.2,69.5 | v86.2,75.3 86.2,70.8 U6.P$1 | U6.P$12 90.75,69.05 v90.1,68.4 | U6.P$10 90.75,67.75 v90.1,68.4 | C11.1 42.6,59.6 41.8,60.4 41.2,60.4 40.7,59.9 40.7,59.3 42.6,57.4 S1.P$3 | U6.P$7 v88.35,66.45 | U6.P$4 v90.1,68.4 | U7.P$63 74.2,55.5 74.7,56 v74.7,57.7 | v54.7,43 53.2,44.4 v53.2,45.6 | U5.P$10 58.4,40.85 58.9,40.35 58.9,39.4 58.4,38.9 U5.P$13 | U5.P$4 64.4,40.2 | C74.1 134.55,19.35 v133.3,18.1 | v125.8,22.9 125.8,23.2 125.4,23.6 124.8,23.6 124.4,23.2 | C55.2 101.55,9.6 v106.8,9.6 | v109.8,12.6 C63.1 | U14.9 v47.7,21.5 | v80,39.8 83.1,42.9 v83.1,43 | C51.2 34.2,23.65 34.2,22.5 35.2,21.5 U14.9 | 63.2,42.1 64,42.1 64.5,41.6 65.1,41.6
  Top 0.305: U7.P$18 59.6,55.5 58.7,55.5 | v64.3,59.5 63.72,58.92 U7.P$12 | C61.2 42,15.2 42.7,15.9 42.7,17.5 42.3,17.9 42.3,19.32 U14.7 | v31.4,47.1 31.9,46.4 32.4,46.4 | v79.1,83.3 79.1,83.7 72.9,89.9 71.7,89.9 v68.4,86.6 | v64.7,86.6 64.42,86.6 P3.P$4 | C14.1 64.35,66.35 64.4,66.4
  Top 0.406: U3.P$24 U3.P$23 149.4,49.54 149.4,50.35 | U3.P$25 U3.P$26 | U3.P$6 U3.P$5 | U4.P$5 U4.P$6 | U4.P$7 U4.P$8 | U4.P$23 U4.P$24 | U4.P$26 U4.P$25
  Top 0.5: Q2.P$1 Q2.P$2
  Top 0.61: U2.P$6 4.4,27.27 C2.P$2 | U2.P$3 U2.P$6 | 4.68,10.88 D1.A 2.1,9 LED4.C | U2.P$5 17.7,23.88 15.99,25.59 15.04,26.54 U2.P$6 | 96.8,7.4 96.83,7.43 Q2.P$2
  Top 0.813: 11.6,29.6 11.75,29.45 13.93,27.27 U2.P$6 | U4.P$24 U4.P$25 20.3,53.5 v19.7,52.9 | U4.P$6 14.2,57.1 | 14.2,57.1 v15.9,57.1 | 14.2,57.1 13.9,57.1 U4.P$7 | C5.P$2 31.4,55.59 C7.2 29.9,52.83 v29.9,52.1 | v151.65,50.35 151.39,50.61 U3.P$25 U3.P$24 | 149.4,50.35 v147.15,50.35 | v142.9,45.35 142.8,45.25 RT2.2 | 140.71,54.35 v142.9,54.35 | U2.P$5 22.04,12.26 C9.P$2
  Top 1: U1.P$1 11.6,33 | 11.6,33 11.6,29.6 | v19.7,45.5 19.7,42.58 | C1.P$2 6.1,37.3 7.3,37.3 11.6,33 | 19.7,42.58 19.72,42.58 24,38.3 24,33.6 15.99,25.59 | U2.P$3 14.3,12.39 | 14.3,12.39 arc90 C8.P$2 | 14.3,12.39 12.51,10.6 4.5,10.6 D1.A | 19.7,42.58 22.4,39.88 C3.P$2 | 17.4,28.9 18.31,29.81 U2.P$7 | U2.P$8 9.86,29.45 11.75,29.45 | C4.P$2 131.2,55.6 v130,55.6
  Top 1.27: J4.4 91.4,5.1 94.9,5.1 96.8,7 96.8,7.4
  Top 1.676: U3.P$6 U3.P$7
  Top 1.778: v25.8,28.9 17.4,28.9 15.04,26.54
  Bottom 0.2: v123.15,39.85 123.65,40.35 v123.65,42.1 | v109.65,38 109.4,38 v107.65,39.75 | v121.9,27.72 121.9,28.6 120.15,30.35 119.15,30.35 v118.4,29.6 118.4,29.1 118.15,28.85 117.65,28.85 117.4,29.1 117.4,31.35 117.15,31.6 v117.15,33.85 114.15,33.85 v112.65,32.45 | v125.4,44.95 125,45.35 v124.5,45.35 122.4,43.35 v122.4,43.05 | v107.65,26.65 107.95,26.35 109.15,26.35 | 109.15,26.35 109.4,26.6 v109.4,28.65 | 111.28,29.48 v111.15,29.35 v111.15,32.45 | v132.9,34.6 133.15,34.35 135.4,34.35 135.65,34.1 v135.65,32.35 | v99.65,26.85 101.15,28.35 104.9,28.35 105.15,28.6 105.5,28.6 v106.4,29.5 | v104.15,51.05 104.15,49.35 v103.65,48.85 103.65,46.9 v107.65,42.85 | v123.8,49.7 v123.8,51.4 | 109.15,26.35 109.25,26.35 109.8,25.8 109.8,23.2 108.5,21.9 108.5,17.3 v109.2,16.6
  Bottom 0.254: v130.15,45.8 128.7,43.85 v126.9,43.85 | v75,39.6 75.4,39.7 75.5,39.8 v80,39.8 | v78.05,42.95 79,43.8 79.2,43.8 | v58,56.55 57.85,56.75 57.45,56.75 | v52.3,62.18 51.97,62.18 JP1.1
  Bottom 0.3: v82.2,69.5 82.2,74.5 83.9,76.2 85.3,76.2 v86.2,75.3 | v88.35,66.45 90.1,68.2 v90.1,68.4 | v74.7,57.7 73.9,58.5 C21.2 | C24.2 57.6,46.2 58.5,45.3 56.2,43 v54.7,43 | v53.2,45.6 53.8,46.2 C18.2 | v133.3,18.1 128.5,18.1 125.8,20.8 v125.8,22.9 | v106.8,9.6 v109.8,12.6 | v47.7,21.5 50.75,24.55 50.95,24.55 | v83.1,43 83.1,43.5 82.8,43.8 79.2,43.8 73.8,43.8 73.15,44.45 C22.2
  Bottom 0.305: 57.45,56.75 C23.2 | v64.3,59.5 C16.1 C10.1 | v29.9,52.1 30.4,52.1 31.4,51.1 v31.4,47.1 | U10.GND 77.92,78.22 79.1,79.4 v79.1,83.3 | v68.4,86.6 v64.7,86.6
  Bottom 0.813: P2.GND 9.17,57.1 v15.9,57.1 19.7,54 v19.7,52.9 20.3,53.5 25.5,53.5 26.9,52.1 v29.9,52.1 | P1.GND 155.67,50.35 v151.65,50.35 | v142.9,45.35 142.9,46.1 v147.15,50.35 146.9,50.35 v142.9,54.35
  Bottom 1: v19.7,45.5 v19.7,52.9 | 84.4,34.3 84.3,34.2 | 46.6,28.9 50.5,32.8 67.3,32.8 70,30.1 82.8,30.1 84.4,31.7 84.4,34.3 | 84.4,34.3 90.7,40.4 90.7,42.2 103.9,55.6 v130,55.6
  Bottom 1.778: 46.6,28.9 v25.8,28.9
  Bottom 2.54: U$1.P$1 67.5,8 50.95,24.55 46.6,28.9
  other vias: 55.5,40.85 82.3,40.1 84.2,37.2 74.2,35.7 62.55,67.5 41.6,51.8 47.4,47.8 47.3,43.6 27.3,44.9 3.1,65.9 28.3,70.3 99.2,75.6 106.6,57.9 119,58.2 147.3,42.1 145.8,72.4 47.5,6.8 65.4,21.3 80,18.1 46.7,32.7 21.9,26.9 7,1.9 9.1,39.5 51.4,45.7 68.1,72.2 143.7,60 139.7,4.3 129.7,24.7 94.5,6.1 114.5,50.5 89.3,59.5 73.1,43.3 25.4,87.9 3.8,83.9 7.8,93.8 45.44,55.68 112.22,44.68
  pour Top (isolate 0.254): 160.1,0.1 0.2,0.1 0.2,95.4 160.1,95.4
  pour Bottom (isolate 0.254): 160.2,0 0.3,0 0.3,95.3 160.2,95.3
IMU_I2C_SCL  (via drill 0.3)
  Top 0.3: U7.P$61 74.9,54.5 76.3,55.9 77.8,55.9 79.2,54.5 80.3,54.5
  Top 0.305: v77.8,79.8 83.8,73.8 v83.8,73.6 | v83.9,65.9 83.9,58.1 80.3,54.5
  Bottom 0.305: U10.SCL 77.8,80.74 v77.8,79.8 | v83.8,73.6 83.9,73.5 v83.9,65.9
IMU_I2C_SDA  (via drill 0.3)
  Top 0.305: v76.1,79.2 84.7,70.6 84.7,57.8 80.4,53.5 U7.P$59
  Bottom 0.305: U10.SDA 76.1,79.9 v76.1,79.2
IMU_SDO_AG  (via drill 0.25, 0.3)
  Top 0.254: U7.P$10 64.7,58.02 64.7,58.8 65.3,59.4 v65.3,59.95 | v69.8,63.4 70.4,64 70.4,70 71,70.6 v71,72.2 | v88.2,89.7 91.96,93.46 U10.SDO_AG
  Bottom 0.254: 69.3,63.4 v69.8,63.4 68.75,63.4 v65.3,59.95 | v71,72.2 73,74.2 74.3,74.2 75.1,75 75.1,76 75.3,76.2 77.7,76.2 88.2,86.7 v88.2,89.7
IMU_SDO_M  (via drill 0.25, 0.3)
  Top 0.254: U7.P$11 64.2,58 v64.2,57 | v58.8,66.2 59.8,67.2 v60.8,67.2
  Bottom 0.254: v64.2,57 61.9,56.9 61,57.8 59.4,57.8 58.5,58.7 58.5,65.9 v58.8,66.2 | v60.8,67.2 69.6,76 69.6,85.9 74.62,90.92 U10.SDO_M
JNTRST  (via drill 0.3)
  Top 0.254: v73.3,52 U7.P$56
  Top 0.3: v68.7,76.9 v71,76.9 | v73.4,75.1 74.3,75.1 v76.6,72.8
  Bottom 0.254: 74.7,52 v73.3,52
  Bottom 0.3: v68.7,76.9 62.22,83.98 62.22,86.52 63.5,87.8 63.5,90.06 P3.P$3 | v71,76.9 71.5,76.8 v73.4,75.1 | v76.6,72.8 76.6,53.9 74.7,52
JTCK  (via drill 0.3)
  Top 0.254: v79.4,63.2 79.4,60.3 v82.1,57.6
  Top 0.3: v75.4,77.2 v79.4,73.4 | v74.9,49.75 73.5,48.5 U7.P$49 | v70.3,77.6 v66.5,77.6 | v62.7,81.8 57.5,81.8 54.6,84.7 54.6,86.3 55.9,87.6 55.9,90.1 54.66,91.34 P3.P$9
  Bottom 0.254: v82.1,57.6 82.1,57.2 77,52.1
  Bottom 0.3: v79.4,73.4 v79.4,63.2 | 77,52.1 75.9,52.1 74.9,51.1 v74.9,49.75 | v75.4,77.2 74,77.2 73.6,76.8 72.2,76.8 71.4,77.6 v70.3,77.6
  Bottom 0.305: v66.5,77.6 64.4,79.6 64.4,80.1 v62.7,81.8
JTDI  (via drill 0.3)
  Top 0.3: U7.P$50 72.7,49 v72.9,49.2 | v76.1,75.4 76,75.4 74.6,76.8 72.2,76.8 71.3,77.7 71.3,77.9 70.9,78.3 v62.9,78.3
  Bottom 0.254: v72.9,49.2 74.1,49.2 74.3,49 83.3,49 83.5,49.2
  Bottom 0.3: v76.1,75.4 77.7,73.8 77.7,62.6 78.5,61.8 83.4,61.8 84.5,60.7 84.5,50.2 83.5,49.2 | v62.9,78.3 61.7,79.5 61.7,81.4 59.68,83.42 59.68,86.48 60.9,87.7 60.9,90.12 P3.P$5
JTDO  (via drill 0.3)
  Top 0.254: U7.P$55 68.4,51.5 68,51.9 v68,52.4
  Top 0.3: v74.1,73.4 71.9,75.6 65.9,75.6 v65.2,76.3
  Bottom 0.254: v68,52.4 68,52.6 69.7,54.3
  Bottom 0.3: 69.7,54.3 70.7,55.3 75.3,55.3 75.8,55.8 75.8,72.5 74.9,73.4 v74.1,73.4 | v65.2,76.3 64.1,77.4 60,77.4 50.8,86.6 50.8,90.06 P3.P$13
JTMS  (via drill 0.3)
  Top 0.254: v79.7,52.3 79.7,52.2 70.4,42.9
  Top 0.3: U7.P$46 68.21,43.91 69.22,42.9 70.4,42.9 | v83.1,60.3 83.1,70.9 74.7,79.5 v60.9,79.5
  Bottom 0.3: v79.7,52.3 83.1,55.6 v83.1,60.3 | v60.9,79.5 57.14,83.46 57.14,86.34 58.4,87.6 58.4,90.08 P3.P$7
M1_A_3.3  (via drill 0.25, 0.3)
  Top 0.254: v57,53.05 58.85,53.05 58.9,53 U7.P$23
  Top 0.305: U5.P$3 63.15,39.5 61.7,39.5 56.8,44.4 55.5,44.4 54.7,45.2 54.7,46.04 53.09,47.65 53.09,49.78 v53.65,50.34
  Bottom 0.254: 56.3,53 56.95,53 v57,53.05
  Bottom 0.305: 56.3,53 v53.65,50.34
M1_A_5
  Top 0.305: P1.A 149.66,62.4 101,62.4 77.5,38.9 U5.P$2
M1_B_3.3  (via drill 0.27, 0.3)
  Top 0.254: U5.P$6 62.3,41.5 61.9,41.9 61.9,43.1 v61.2,43.8 | v62.45,45.2 62.4,45.5 62.22,45.68 U7.P$34
  Bottom 0.254: v61.2,43.8 61.2,44 v62.45,45.2
M1_B_5
  Top 0.254: U5.P$5 65.25,40.85 65.8,40.3 75.4,40.3 75.8,39.9 77.3,39.9
  Top 0.3: 78.25,40.85 77.3,39.9
  Top 0.305: P1.B 155.95,58.45 151.2,63.2 100.6,63.2 78.25,40.85
M2_A_3.3  (via drill 0.3)
  Top 0.254: U7.P$25 59.67,51.95 53.35,51.95 52.5,51.1
  Top 0.305: v53.8,42.6 52.5,43.9 52.5,46.43 51.77,47.17 51.77,50.37 52.5,51.1 | U5.P$11 54.83,40.1 v54.4,40.4
  Bottom 0.305: v54.4,40.4 53.9,41.1 v53.8,42.6
M2_A_5  (via drill 0.3)
  Top 0.254: U5.P$12 32.05,39.55 v28.3,43.3
  Bottom 0.254: v28.3,43.3 5,43.3 3.5,44.8 3.5,56.51 P2.A
M2_B_3.3
  Top 0.305: U5.P$8 56.55,42.15 54,44.7 | U7.P$26 53.79,51.5 52.4,50.11 52.4,47.37 54,45.77 54,44.7 | 54,44.7
M2_B_5  (via drill 0.3)
  Top 0.254: U5.P$9 v42.2,41.5
  Bottom 0.254: v42.2,41.5 5.1,41.5 2.3,44.3 2.3,57.85 P2.B
MC1_IN1  (via drill 0.3)
  Top 0.3: R1.1 132.29,50.9 126.8,50.9 126.4,51.3 126.4,52 124.4,54 117.9,54 116.8,52.9 v114.4,52.9 | v108.3,49.9 107.4,48.7 v105.1,48.7 | v104.5,47.2 104.1,46.8 101.6,46.8 101,47.4 v99.6,47.4 | v85.5,33.9 84.4,32.8 v83.1,32.8 | v79.8,36.1 77.7,38.2 v75.3,38.2 | v63.6,43 64.22,43.62 U7.P$38
  Bottom 0.254: 86.1,33.9 86.8,33.9 90.5,37.6 90.5,38.9 99,47.4 v99.6,47.4
  Bottom 0.3: v114.4,52.9 111.4,49.9 v108.3,49.9 | v105.1,48.7 104.5,48.1 v104.5,47.2 | 86.1,33.9 v85.5,33.9 | v83.1,32.8 v79.8,36.1 | v75.3,38.2 73.4,40.1 65.8,40.1 63.6,41.9 v63.6,43
MC1_IN2  (via drill 0.25, 0.3)
  Top 0.254: v87.3,45.6 87.5,45.4 v87.4,41.7
  Top 0.3: U7.P$37 63.7,46.48 63.7,45.4 v63.4,44.8 | v89.6,43.4 94.2,48.1 94.2,49 94.6,49.4 94.6,49.5 95.4,50.3 106.2,50.3 107.7,51.8 115.1,51.8 116.3,50.6 124.4,50.6 126.7,48.3 v127.4,48.3 | v130.5,48.3 131.94,46.86 R3.1
  Bottom 0.254: v87.4,41.7 87.8,41.4 88.3,41.4 89.5,42.6 v89.6,43.4 | v63.4,44.8 63.4,44.5 63.7,44.2 | 70.6,47.4 70.7,47.5
  Bottom 0.3: 63.7,44.2 64.1,44.2 64.7,44.8 67.1,44.8 69.1,46.8 70,46.8 70.6,47.4 | 87,47.4 87.3,47.1 | 87.3,47.1 v87.3,45.6 | v127.4,48.3 v130.5,48.3 | 70.7,47.5 86.9,47.5 87.3,47.1
MC1_INH_3.3  (via drill 0.3)
  Top 0.254: 75.6,41.3 76,41.7 76,42.1 82.6,48.7 83.4,48.7 87.1,52.4 v87.1,52.9
  Top 0.305: U6.P$2 88.2,69.7 89.1,70.6 89.1,71.5 88.8,71.8 v87.9,71.8 | 75.6,41.3 66.1,41.3 65.22,42.18 U7.P$40
  Bottom 0.305: v87.1,52.9 87.1,71 v87.9,71.8
MC1_INH_5  (via drill 0.3)
  Top 0.305: U6.P$3 86.7,69 88.5,69 90.5,71 108.3,71 108.7,70.6 v108.7,68 | v127.4,58.7 126.3,57.6 126.3,55.1 128.29,53.11 R5.2
  Bottom 0.305: v108.7,68 112.1,64.6 123.8,64.6 127.4,61 v127.4,58.7
MC1_IS  (via drill 0.25, 0.3)
  Top 0.254: R9.1 R7.2 | U7.P$8 65.7,58.02 65.7,58.6 66.1,59 v66,59.2 | 71.3,59.6 75,63.3 75,64.5 75.7,65.2 v82.1,65.2
  Top 0.3: v111.3,66.8 v105.6,66.8 | v89.2,64.7 86.5,64.7 v86.1,65.1 | 71.3,59.6 v69.85,59.6
  Top 0.305: v150.8,60.1 150.4,59.7 148,59.7 147.3,59 v138.5,59 | v125.8,50.9 126.86,49.84 R7.2
  Bottom 0.254: v66,59.2 66.6,59.6 v69.85,59.6 | v82.1,65.2 86,65.2 v86.1,65.1
  Bottom 0.3: 150.8,60.9 150.8,61.9 145.9,66.8 v111.3,66.8 | v105.6,66.8 91.3,66.8 v89.2,64.7
  Bottom 0.305: 150.8,60.9 v150.8,60.1 | v138.5,59 133.5,54 126.8,54 125.8,53 v125.8,50.9
MC2_IN1  (via drill 0.3)
  Top 0.254: U7.P$58 80.8,53 85.7,57.9 v85.7,61.7 | v78.6,68.8 78.6,71.5 78.1,72 72.9,72 70.6,74.3 64.9,74.3 62,71.4 50.8,71.4 49.2,73 v42.7,73 | v40.1,62.3 v40.1,58.2 | v40.5,53.8 v40.5,48.7 | v32.6,48.7 30.84,50.46 R2.2
  Bottom 0.254: v85.7,61.7 84.9,62.5 79,62.5 78.6,62.9 v78.6,68.8 | v42.7,73 41.7,73 39.6,70.9 39.6,64.2 40.1,63.7 v40.1,62.3 | v40.1,58.2 40.5,57.8 v40.5,53.8 | v40.5,48.7 40,48.2 39.1,48.2 38.6,48.7 v32.6,48.7
MC2_IN2  (via drill 0.3)
  Top 0.254: U7.P$62 68,55 66.4,53.4 v66.4,48.7 | v63,48.4 62.6,48 59.5,48 59.2,47.7 v59.2,44.3 | v55.4,42.3 55.1,41.9 53.4,41.9 50.2,45.1 v45.4,45.1 | v31.4,45.6 29.76,47.24 R4.1
  Bottom 0.254: v66.4,48.7 65.8,48.4 v63,48.4 | v59.2,44.3 57,42.3 v55.4,42.3 | v45.4,45.1 44.9,45.6 v31.4,45.6
MC2_INH_3.3
  Top 0.3: U6.P$5 88.9,67.75 90,66.65 90,65.4
  Top 0.305: 90,65.4 90,61.5 70.8,42.4 68.5,42.4 67.72,43.08 U7.P$45
MC2_INH_5  (via drill 0.25, 0.3)
  Top 0.254: U6.P$6 85.5,67.1 85.3,66.9 85.3,64.7 85.6,64.4 85.9,64.4 v86.4,63.9 | v81.3,71.7 80.3,72.7 77.7,72.7 74.2,76.2 66.6,76.2 65.7,77.1 v53.9,77.1 | v46.7,70.1 46.9,69.9 46.9,66.5 46.2,65.8 42.6,65.8 38.9,62.1 38.9,55.2 39.8,54.3 v39.8,49.6 | v37.1,51.4 35.61,52.89 R6.2
  Bottom 0.254: v81.3,71.7 81.3,63.5 81.8,63 83.8,63 83.9,62.9 85.7,62.9 86.4,63.6 v86.4,63.9 | v53.9,77.1 53.5,77.5 47.1,77.5 46.7,77.1 v46.7,70.1 | v39.8,49.6 39.3,49.1 38.7,49.1 37.1,50.7 v37.1,51.4
MC2_IS  (via drill 0.25, 0.3, 0.5)
  Top 0.254: R10.1 35.67,49.24 R8.2 | v60.5,41.9 60.5,43.1 59.9,43.8 59.9,46.5 60.5,47.2
  Top 0.305: U7.P$9 65.2,57.98 v65.2,57 | v64.5,55.5 64.5,55.2 65.5,54.2 65.5,49.5 63.5,47.5 60.8,47.5 60.5,47.2 | v50,37.8 49.6,38.2 v36.3,38.2 | v34.5,40.7 34.5,45.1 35.1,45.7 36.3,45.7 36.9,46.3 36.9,48.5 36.16,49.24 35.67,49.24
  Bottom 0.305: v65.2,57 v64.5,55.5 | v60.5,41.9 60.5,38.8 59.1,37.4 52.9,37.4 52.5,37.8 v50,37.8 | v36.3,38.2 34.5,40 v34.5,40.7
N$1
  Top 0.406: U3.P$3 139.9,56.1 U3.P$4 | 149.65,56.35 149.63,56.33 U3.P$33 149.9,56.08 149.9,56.85
  Top 0.813: U3.P$1 139.9,57.6 | 139.9,57.6 U3.P$2 | U3.P$2 U3.P$3 139.9,56.35 | 139.9,56.1 U3.P$2 | 139.9,57.6 140.06,57.76 U3.P$36 U3.P$35 U3.P$34 149.65,56.44 149.65,56.35 | 149.9,56.85 152.65,56.85 153.4,56.1 153.4,47.1 153.75,45.75 P1.MOTOR+
N$2  (via drill 0.8)
  Top 0.406: U3.P$16 U3.P$15 | U3.P$21 U3.P$22 149.15,48.18 149.15,46.85 149.01,46.71 U3.P$18
  Top 0.813: v150.65,45.1 149.63,46.12 U3.P$19 U3.P$20 U3.P$21 | U3.P$18 U3.P$17 U3.P$16
  Bottom 0.813: P1.MOTOR- 152.96,45.1 v150.65,45.1
N$3  (via drill 0.3)
  Top 0.254: U3.P$9 139.86,52.6 v137.9,52.6 | v135.65,51.35 135.13,50.83 R1.2
  Bottom 0.254: v137.9,52.6 136.65,51.35 v135.65,51.35
N$4  (via drill 0.3)
  Top 0.254: U3.P$10 139.84,51.85 138.65,51.85 138.15,51.35 v137.9,51.35 | v137.15,49.4 137.15,47.1 136.91,46.86 R3.2
  Bottom 0.254: v137.9,51.35 137.15,50.6 v137.15,49.4
N$5  (via drill 0.3)
  Top 0.254: U3.P$28 149.59,52.6 147,52.6 143,48.6 v141.9,48.6 | v131.9,48.6 130.66,49.84 R7.1
  Bottom 0.254: v141.9,48.6 v131.9,48.6
N$6  (via drill 0.3)
  Top 0.254: U3.P$27 149.57,51.85 147.35,51.85 143.1,47.6 v141.65,47.6 | v136.4,47.85 136.15,48.1 v136.15,49.6 | v130.65,51.6 130.09,52.16 R5.1
  Bottom 0.254: v141.65,47.6 141.4,47.85 v136.4,47.85 | v136.15,49.6 133.9,51.6 v130.65,51.6
N$7
  Top 0.3: R19.2 2.8,89 6,92.2 10.2,92.2 12.25,90.15 U8.P$2
N$8
  Top 0.254: U4.P$33 23.65,58.96 23.65,59.06
  Top 0.406: U4.P$3 U4.P$4
  Top 0.813: P2.MOTOR+ 10.9,53.75 10.9,58.6 11.65,59.35 U4.P$3 U4.P$2 U4.P$1 U4.P$36 U4.P$35 U4.P$34 23.63,59.06 23.65,59.06
N$9  (via drill 0.6)
  Top 0.4: U4.P$16 U4.P$15
  Top 0.406: U4.P$21 U4.P$22
  Top 0.813: v10.9,50.6 11.2,50.9 U4.P$16 U4.P$17 U4.P$18 U4.P$19 U4.P$20 U4.P$21
  Bottom 0.813: P2.MOTOR- 5.59,50.6 v10.9,50.6
N$10  (via drill 0.5)
  Top 0.305: R2.1 26.26,50.46 v26.2,50.4 | v23.4,48.2 v17.4,48.2 | v16,55.2 15.7,55.5 13.95,55.5 U4.P$9
  Bottom 0.305: v26.2,50.4 25.6,50.4 v23.4,48.2 | v17.4,48.2 17.1,48.5 17.1,54.1 v16,55.2
N$11  (via drill 0.6)
  Top 0.254: R4.2 27.46,47.1 v16.9,47.1 | v11.9,53.1 11.9,54.1 12.6,54.8 U4.P$10
  Bottom 0.254: v16.9,47.1 11.9,52.1 v11.9,53.1
N$12
  Top 0.254: R12.2 71.4,67.85 Y1.P$1 72.9,69.1 73.15,69.35 C12.2
N$13  (via drill 0.3)
  Top 0.254: R8.1 32.9,51.42 v32.9,52.1 | v25.9,56.1 25.25,55.45 U4.P$28
  Bottom 0.254: v32.9,52.1 33.4,52.6 33.4,54.6 31.9,56.1 v25.9,56.1
N$14  (via drill 0.3)
  Top 0.254: R6.1 33.67,53.6 v32.4,53.6 | v25.9,54.6 25.7,54.8 U4.P$27
  Bottom 0.254: v32.4,53.6 31.4,54.6 v25.9,54.6
N$15  (via drill 0.25)
  Top 0.254: U7.P$47 68.7,46.48 68.7,45.2 v68.9,45
  Bottom 0.254: v68.9,45 C17.1
N$16  (via drill 0.3)
  Top 0.254: v57.3,49 U7.P$31
  Bottom 0.254: C18.1 56.5,49 v57.3,49
N$17
  Top 0.254: Y2.P$4 56.6,61.55 C15.2 60.9,59.6 61.9,60.6 61.9,62.6 62.55,63.25 R15.2
N$18
  Top 0.254: R13.2 68.4,67.85 Y1.P$2 66.9,69.1 66.65,69.35 C13.2
N$19
  Top 0.254: R14.1 67.22,60.38 U7.P$5
N$20
  Top 0.254: Y2.P$1 60.15,65.6 60.9,66.35 C14.2 62.5,65.5 63.15,64.85 64.55,64.85 R14.2
N$21
  Top 0.254: R13.1 68.5,61.35 | 67.72,59.22 U7.P$4
  Top 0.305: 67.72,59.22 68.4,59.9 R13.1
N$22  (via drill 0.3)
  Top 0.254: 51.2,62.1 51.2,62.38 51.99,63.17 52.24,63.17 57.14,68.07
  Top 0.3: U7.P$60 77.2,54 77.5,54.3 v77.5,55 | v77.5,57 v74.3,60.2 | v66.1,64.6 65.1,65.7 65.1,67.4 64.5,68 | 51.2,62.1 v51.1,62.1 | v47.5,61.4 47.5,60.8 48.1,60.2 48.6,60.2 R11.2
  Top 0.305: 57.1,68 57.14,68.07 57.23,68.2 64.38,68.23 arc-90 64.5,68
  Bottom 0.3: v77.5,55 v77.5,57 | v74.3,60.2 69.9,64.6 v66.1,64.6 | v51.1,62.1 48.2,62.1 v47.5,61.4
N$23
  Top 0.3: JP1.2 50.55,61.06 R11.1
N$24
  Top 0.305: R20.2 52.3,86.3 53.3,87.3 53.3,90.1 P3.P$11
N$25
  Top 0.305: R21.2 46.2,87.2 45.8,87.6 45.8,89.98 P3.P$17
N$26
  Top 0.305: R24.2 40.9,84.9 39.8,86 39.8,89.24 P3.P$19
N$27
  Top 2.184: JP2.1 57.7,30.85 57.7,31.5
  Top 2.54: F3.2 57.7,31.4 57.7,31.5
N$28
  Top 0.254: 11.75,87.75 9.6,89.9 R17.2
  Top 0.305: 11.75,87.75 U8.P$4
N$29
  Top 0.254: U7.P$3 68.22,59.07 70.6,61.45 R12.1
N$30
  Top 0.254: U7.P$6 66.72,60.03 66.15,60.6 63.8,60.6 63.4,61 R15.1
N$31  (via drill 0.6, 0.8)
  Top 0.61: D1.C 4.8,17.5 | v23.9,20.6 24.4,21.1 24.4,22.6 L1.P$2
  Top 0.813: U2.P$2 12.6,18.9 v11.4,20.1
  Top 1: 4.8,17.5 v7.4,20.1
  Bottom 0.61: 23.4,20.1 v23.9,20.6
  Bottom 0.813: v7.4,20.1 v11.4,20.1 23.4,20.1
N$32
  Top 2.54: S2.P$3 67.7,11.75 U$1.P$2
N$33  (via drill 0.3)
  Top 0.2: R41.2 98.5,30.5 v98.15,30.85 | v96.15,31.6 R47.1
  Top 0.5: v92.65,31.35 94.8,31.35 R47.1
  Bottom 0.2: v98.15,30.85 96.9,30.85 v96.15,31.6
  Bottom 0.5: v92.65,31.35 89.4,28.1 89.4,22.6 85.65,18.85 J4.3
N$34
  Top 0.305: U8.P$10 12.6,78.1 R22.2
N$35
  Top 0.305: R22.1 LED1.A
N$36
  Top 0.305: U8.P$11 16.4,78.9 17.2,78.1 R23.2
N$37
  Top 0.305: U8.P$12 17.6,79.3 19.6,77.3 R25.2
N$38
  Top 0.305: R23.1 17.3,75.5 LED2.A
N$39
  Top 0.305: R25.1 21.8,75.4 LED3.A
N$40
  Top 0.2: U13.P$2 U13.P$3 104.9,34.35 105.4,34.85 | C47.1 107.4,33.2 107.4,34.35 106.9,34.85 105.4,34.85 | 105.4,34.85 105.4,34.6 | 105.4,34.6 105.4,34.35 105.15,34.35 105.4,34.6 | R37.2 102.9,41 102.9,37.1 103.4,36.6 104.4,36.6 105.4,35.6 105.4,34.85
N$41  (via drill 0.3)
  Top 0.254: U7.P$2 68.72,58.8 68.92,59 69.55,59 69.75,58.8 71.9,58.8
  Top 0.3: 71.9,58.8 77.3,64.2 v82.3,64.2 | v85.45,63.6 86.2,62.9 v88.8,62.9 | v95.2,65.7 98.4,68.9 v100.6,68.9 | v136.9,84.3 138.2,85.6 LED8.A
  Bottom 0.3: v82.3,64.2 82.7,63.8 v85.45,63.6 | v88.8,62.9 91.6,65.7 v95.2,65.7 | v100.6,68.9 102,70.3 107.8,70.3 107.9,70.4 135.7,70.4 136.9,71.6 v136.9,84.3
N$42
  Top 0.61: LED4.A 5.4,6.2 R74.1
N$43  (via drill 0.3)
  Top 0.254: U7.P$52 68.7,50 67.6,51.1 v67.1,51.1
  Bottom 0.254: v67.1,51.1 64.05,51.1 J8.1
N$44
  Top 0.2: R81.2 C77.1 R80.1
N$45
  Top 0.2: R80.2 R79.1 35.1,34 34.6,33.5 34.6,30.7 35,30.3 C76.1
N$46  (via drill 0.25, 0.3)
  Top 0.2: 101.65,25 R38.2 101.99,25.04 C78.1 103.4,28.31 103.4,29.6 102.8,30.2 102,30.2 101.65,30.55 v101.65,31.1 | v102.9,33.6 102.9,33.85 104.15,35.1 104.4,34.85 U13.P$4 | C47.2 109.15,32.95 v109.1,31.55
  Top 0.254: 104.15,35.1 104.3,35.25 v104.75,35.25
  Bottom 0.2: v101.65,31.1 102.9,32.35 v102.9,33.6 | v109.1,31.55 108.9,31.35 107.4,31.35 105.15,33.6 105.15,34.85
  Bottom 0.254: 105.15,34.85 v104.75,35.25
N$47
  Top 0.2: R79.2 37.3,30.9 37.3,29.1 37.9,28.5 C75.1 37.8,27.7 37.1,27.7 36.45,27.05 C50.1
N$48
  Top 0.254: U8.P$3 12.65,89 11.9,89 9.6,91.3 6.3,91.3 5.7,90.7 R18.2
N$49
  Top 0.2: Q2.P$8 Q2.P$7 Q2.P$6 Q2.P$5
  Top 0.406: Q2.P$9 93.97,9.35 Q2.P$6
  Top 0.5: Q2.P$5 93.97,10.54 93.9,10.6
  Top 2: 80.4,23.6 80.4,21.85 90.65,11.6 92.04,11.6 Q2.P$6
  Top 3: F1.2 F2.1 82.45,25.65 80.4,23.6
N$50
  Top 0.2: C40.1 130.2,6 R34.1
N$51
  Top 0.2: C39.1 119.4,6.7 119.4,8.1 120.42,9.12 U11.5 U11.4
N$52